# EAGLE design pc-004 (EAGLE 9.6.2)

## Sheet 1 of 2
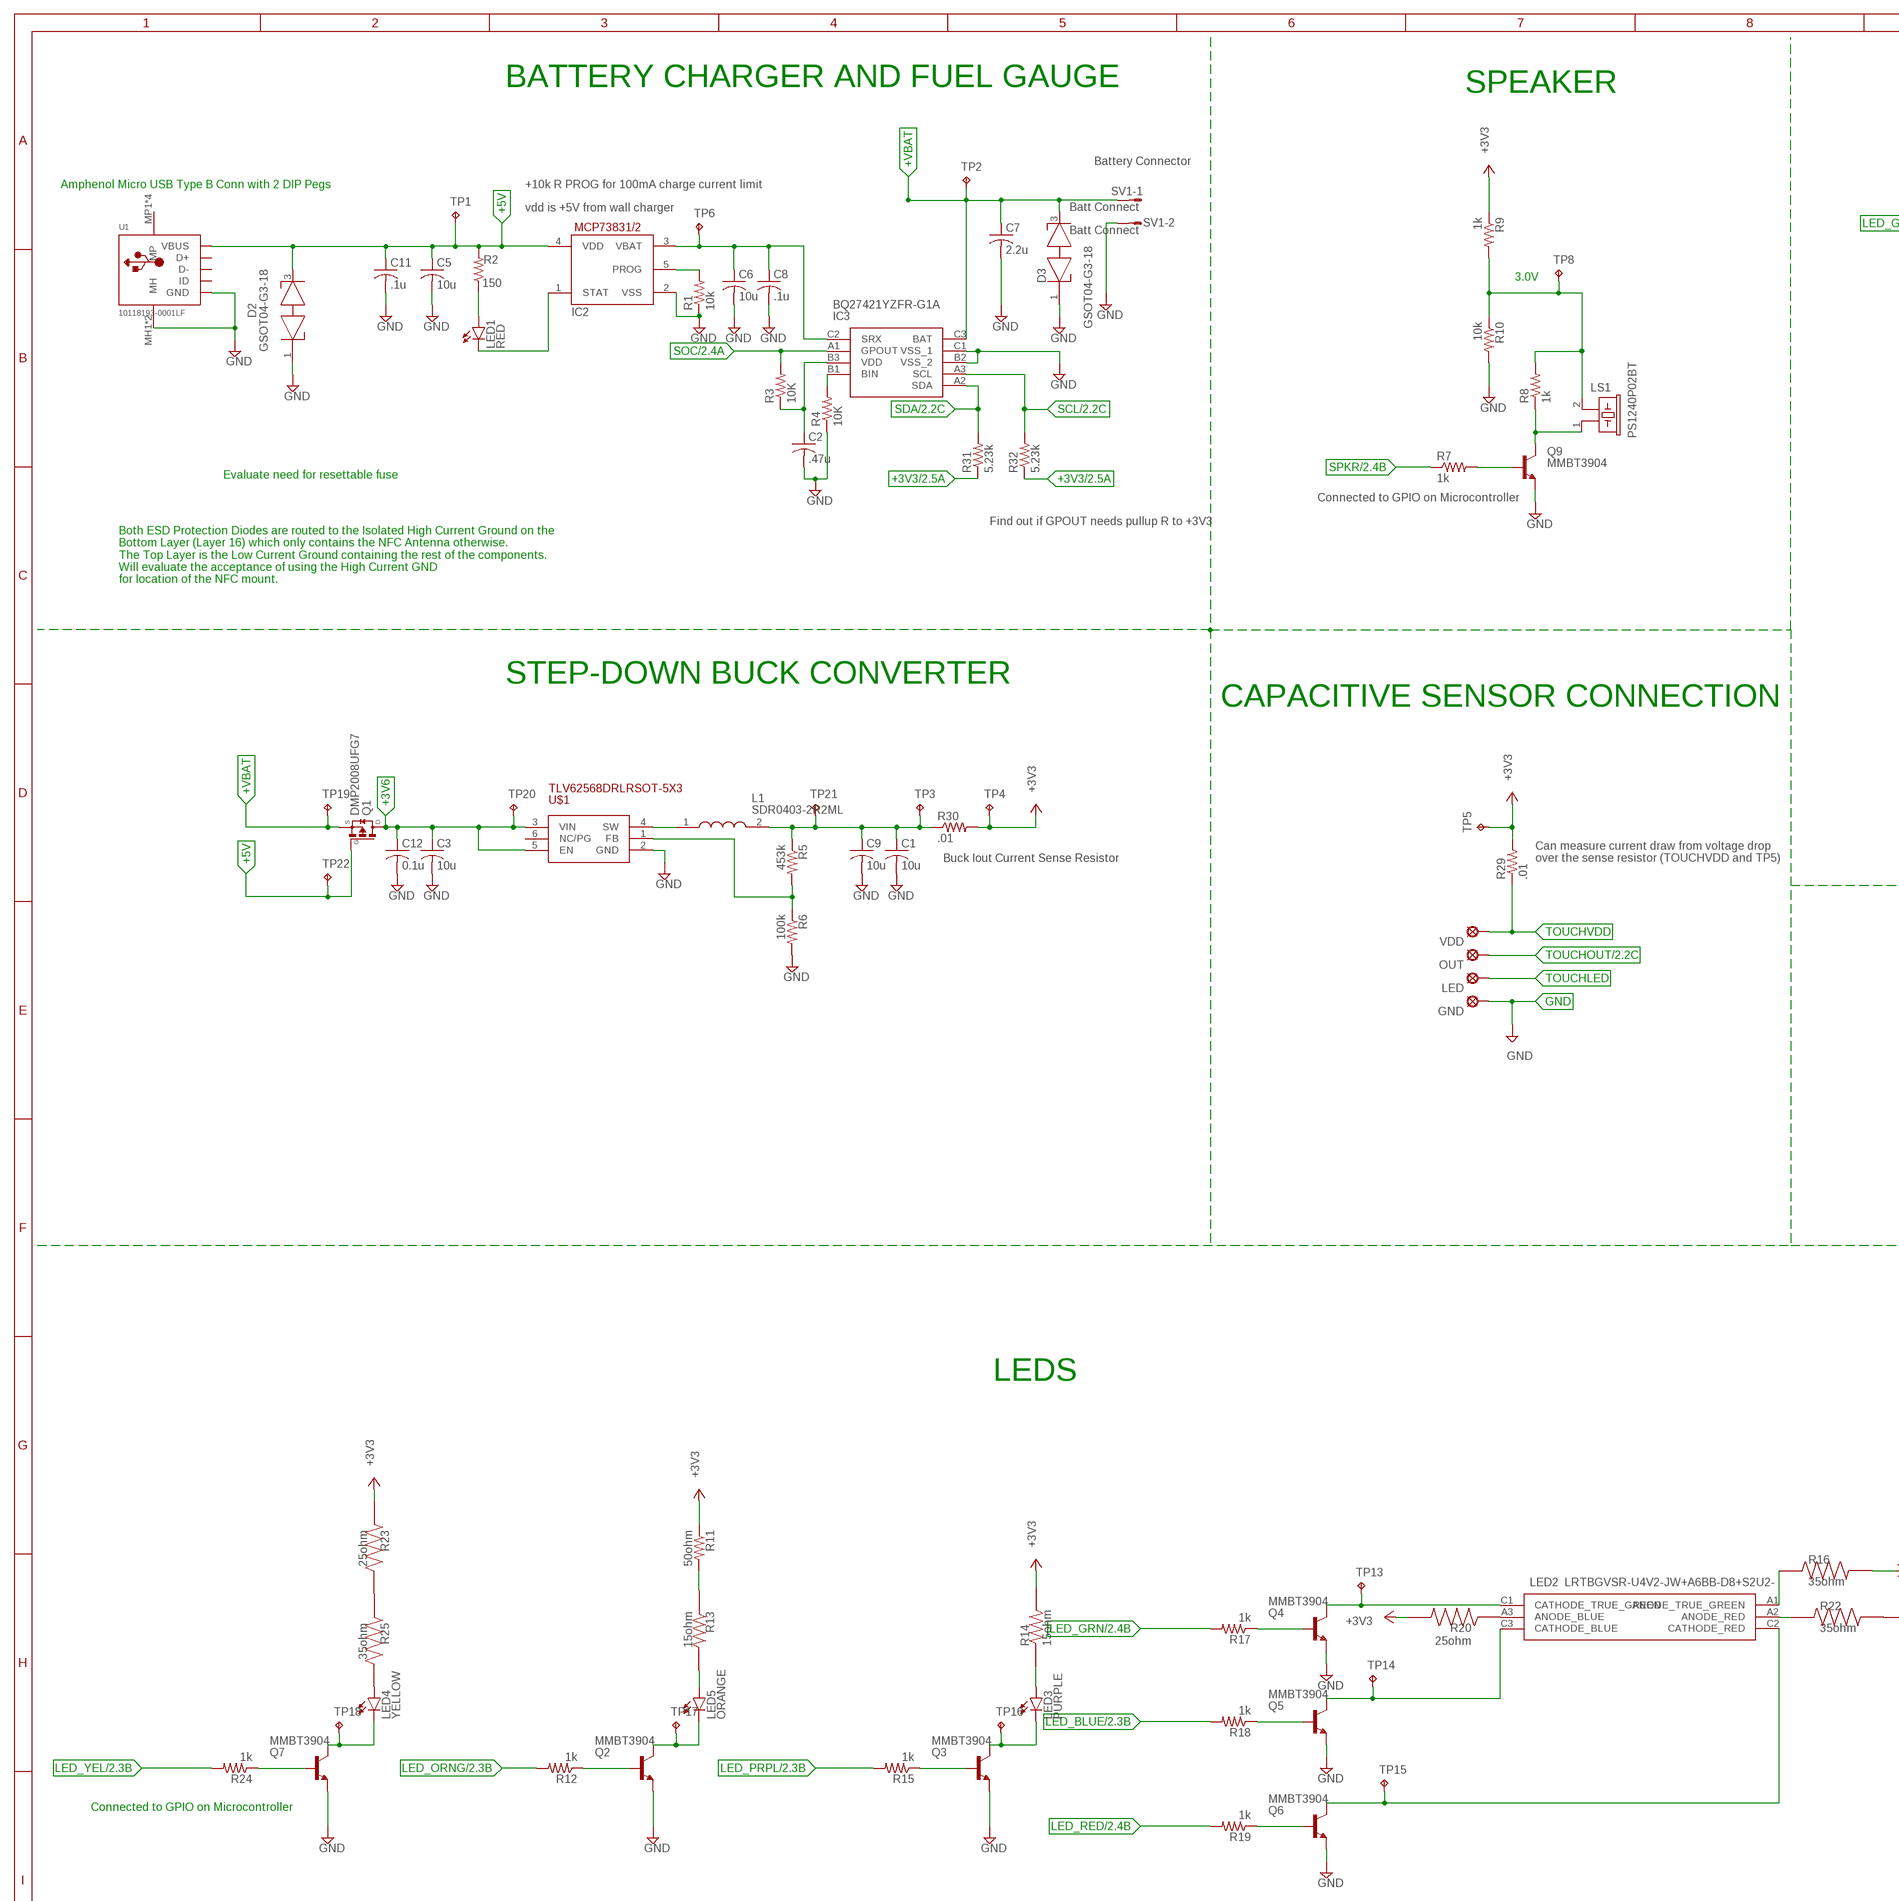
[diagram p0: schematic, sheet 1, part 1 of 2]
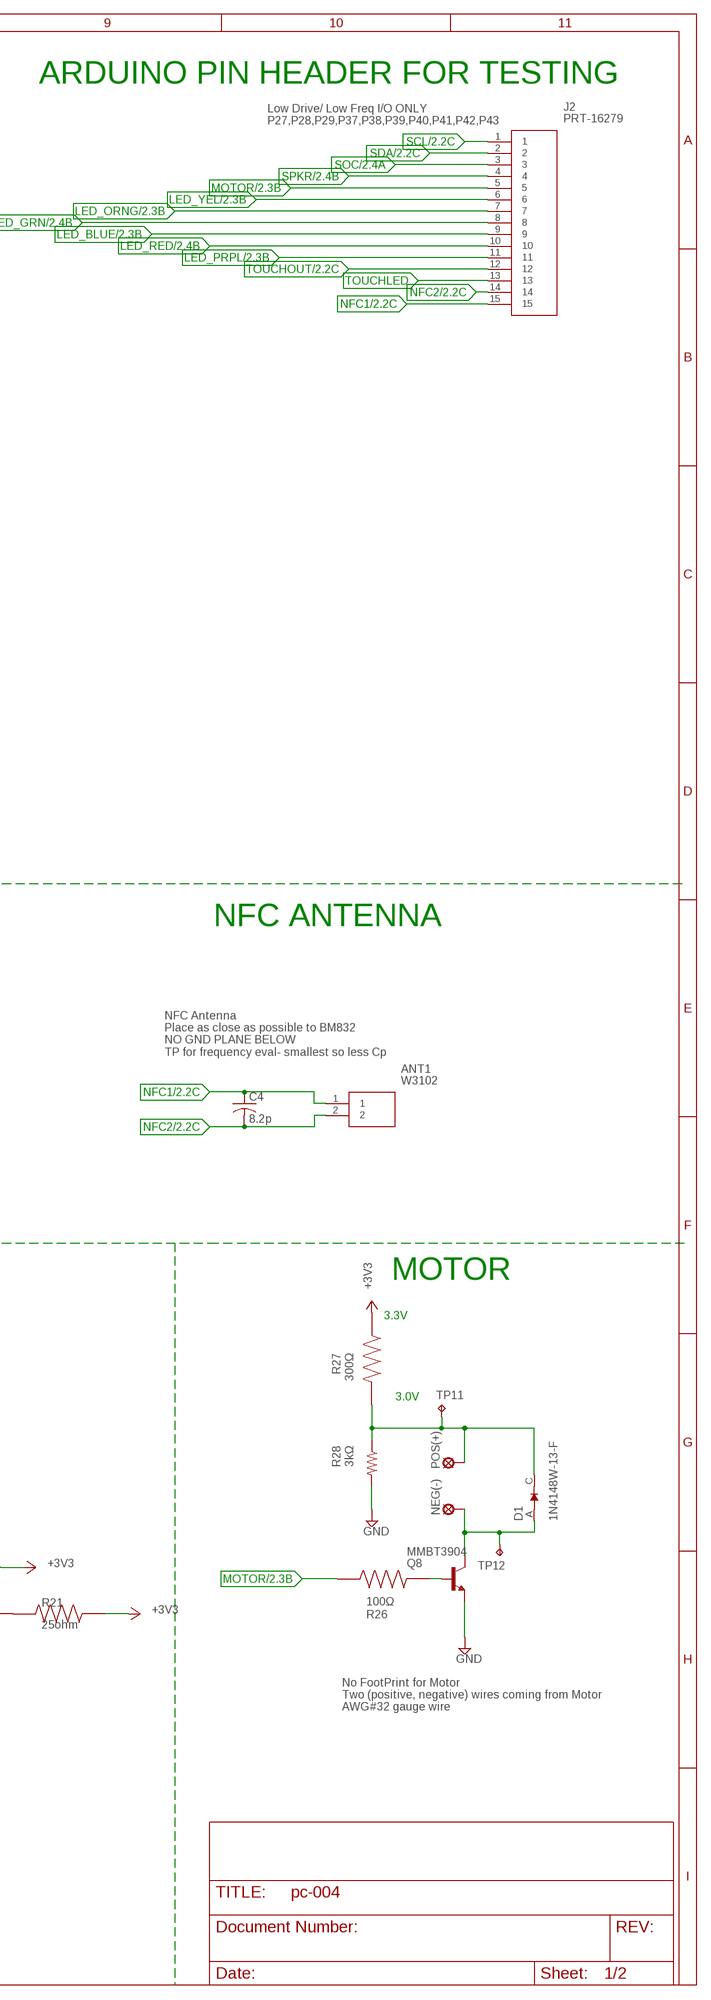
[diagram p1: schematic, sheet 1, part 2 of 2]

### Parts
ANT1  W3102  [W3102]
C1  10u  CL21A106KOQNNNE  [CAPC2012X140N]
C2  .47u  C-USC0603  [C0603]
C3  10u  CL21A106KOQNNNE  [CAPC2012X140N]
C4  8.2p  C-USC0402K  [C0402K]
C5  10u  CL21A106KOQNNNE  [CAPC2012X140N]
C6  10u  CL21A106KOQNNNE  [CAPC2012X140N]
C7  2.2u  C-USC0603  [C0603]
C8  .1u  C-USC0603  [C0603]
C9  10u  CL21A106KOQNNNE  [CAPC2012X140N]
C11  .1u  C-USC0603  [C0603]
C12  0.1u  C-USC0603  [C0603]
D1  1N4148W-13-F  [SOD3715X135N]
D2  GSOT04-G3-18  [SOT23]
D3  GSOT04-G3-18  [SOT23]
GND  LSP10  [LSP10]
IC2  MCP73831/OT  [SOT23-5L]
IC3  BQ27421YZFR-G1A  [BGA9C50P3X3_158X162X62]
J2  PRT-16279  [PRT16279]
L1  SDR0403-2R2ML  [SDR04032R2ML]
LED  LSP10  [LSP10]
LED1  RED  150060RS75000  [LEDC1608X80N]
LED2  LRTBGVSR-U4V2-JW+A6BB-D8+S2U2-  [LRTBGVSRU4V2JWA6BBD8S2U27Z20S]
LED3  PURPLE  APTR3216-VFX  [LEDC3216X125N]
LED4  YELLOW  SML-D15YWT86CYELLOW  [SML0603]
LED5  ORANGE  SML-D15YWT86CORANGE  [SML0603]
LS1  PS1240P02BT  [PS1240P02BT]
NEG(-)  LSP10  [LSP10]
OUT  LSP10  [LSP10]
POS(+)  LSP10  [LSP10]
Q1  DMP2008UFG7  DMP2008UFG  [DMP2008UFG7]
Q2  MMBT3904  MMBT3904-7-FNSMD  [SOT23]
Q3  MMBT3904  MMBT3904-7-FNSMD  [SOT23]
Q4  MMBT3904  MMBT3904-7-FNSMD  [SOT23]
Q5  MMBT3904  MMBT3904-7-FNSMD  [SOT23]
Q6  MMBT3904  MMBT3904-7-FNSMD  [SOT23]
Q7  MMBT3904  MMBT3904-7-FNSMD  [SOT23]
Q8  MMBT3904  MMBT3904-7-FNSMD  [SOT23]
Q9  MMBT3904  MMBT3904-7-FNSMD  [SOT23]
R1  10k  R-US_R0402  [R0402]
R2  150  R-US_R0402  [R0402]
R3  10K  R-US_R0402  [R0402]
R4  10K  R-US_R0402  [R0402]
R5  453k  R-US_R0402  [R0402]
R6  100k  R-US_R0603  [R0603]
R7  1k  CRCW06031K00FKEAC  [RESC1608X55N]
R8  1k  CRCW06031K00FKEAC  [RESC1608X55N]
R9  1k  CRCW06031K00FKEAC  [RESC1608X55N]
R10  10k  R-US_R0402  [R0402]
R11  50ohm  RT0402BRE0750RL  [RESC1005X35N]
R12  1k  CRCW06031K00FKEAC  [RESC1608X55N]
R13  15ohm  SR0603JR-0715RL  [RESC1608X55N]
R14  15ohm  SR0603JR-0715RL  [RESC1608X55N]
R15  1k  CRCW06031K00FKEAC  [RESC1608X55N]
R16  35ohm  RT0603BRD0735R2L  [RESC1608X55N]
R17  1k  CRCW06031K00FKEAC  [RESC1608X55N]
R18  1k  CRCW06031K00FKEAC  [RESC1608X55N]
R19  1k  CRCW06031K00FKEAC  [RESC1608X55N]
R20  25ohm  RQ73C2A25R5BTD  [RESC2012X65N]
R21  25ohm  RQ73C2A25R5BTD  [RESC2012X65N]
R22  35ohm  RT0603BRD0735R2L  [RESC1608X55N]
R23  25ohm  RQ73C2A25R5BTD  [RESC2012X65N]
R24  1k  CRCW06031K00FKEAC  [RESC1608X55N]
R25  35ohm  RT0603BRD0735R2L  [RESC1608X55N]
R26  100Ω  SR0603FR-7T100RL  [RESC1608X55N]
R27  300Ω  CRCW1206300RFKEAC  [RESC3015X65N]
R28  3kΩ  CR1206-FX-3001ELF  [RESC3216X75N]
R29  .01  R-US_R0603  [R0603]
R30  .01  PCS1206DR0100ET  [RESC3216X68N]
R31  5.23k  R-US_R0603  [R0603]
R32  5.23k  R-US_R0603  [R0603]
SV1  Batt Connect  L02P  [L02P]
TP1  TESTPOINT  [TESTPOINT_PAD-036]
TP2  TESTPOINT  [TESTPOINT_PAD-036]
TP3  TESTPOINT  [TESTPOINT_PAD-036]
TP4  TESTPOINT  [TESTPOINT_PAD-036]
TP5  TESTPOINT  [TESTPOINT_PAD-036]
TP6  TESTPOINT  [TESTPOINT_PAD-036]
TP8  TESTPOINT  [TESTPOINT_PAD-036]
TP11  TESTPOINT  [TESTPOINT_PAD-036]
TP12  TESTPOINT  [TESTPOINT_PAD-036]
TP13  TESTPOINT  [TESTPOINT_PAD-036]
TP14  TESTPOINT  [TESTPOINT_PAD-036]
TP15  TESTPOINT  [TESTPOINT_PAD-036]
TP16  TESTPOINT  [TESTPOINT_PAD-036]
TP17  TESTPOINT  [TESTPOINT_PAD-036]
TP18  TESTPOINT  [TESTPOINT_PAD-036]
TP19  TESTPOINT  [TESTPOINT_PAD-036]
TP20  TESTPOINT  [TESTPOINT_PAD-036]
TP21  TESTPOINT  [TESTPOINT_PAD-036]
TP22  TESTPOINT  [TESTPOINT_PAD-036]
U1  10118193-0001LF  [101181930001LF]
U$1  TLV62568DRLRSOT-5X3  [SOT50P160X60-6N]
VDD  LSP10  [LSP10]

### Nets
+3V3: R9.1 R11.1 R14.2 R16.2 R20.2 R21.2 R23.1 R27.1 R29.2 R30.2 R31.1 R32.1 TP4.1(TP) TP5.1(TP) ; also sheet 2
+3V6: C3.1 C12.1 Q1.5(D) Q1.6(D) Q1.7(D) Q1.8(D) Q1.9(D) TP20.1(TP) U$1.3(VIN) U$1.5(EN)
+5V: C5.1 C11.1 D2.3(K2) IC2.4(VDD) Q1.4(G) R2.2 TP1.1(TP) TP22.1(TP) U1.1(VBUS)
+VBAT: C7.1 D3.3(K2) IC3.C3(BAT) Q1.1(S) Q1.2(S) Q1.3(S) SV1.1 TP2.1(TP) TP19.1(TP)
GND: C1.2 C2.2 C3.2 C5.2 C6.2 C7.2 C8.2 C9.2 C11.2 C12.2 D2.1(K1) D3.1(K1) GND.MP IC2.2(VSS) IC3.B2(VSS_2) IC3.C1(VSS_1) Q2.2(E) Q3.2(E) Q4.2(E) Q5.2(E) Q6.2(E) Q7.2(E) Q8.2(E) Q9.2(E) R1.1 R4.1 R6.2 R10.2 R28.2 SV1.2 U1.5(GND) U1.MH1(MH) U1.MH2(MH) U$1.2(GND) ; also sheet 2
LED_BLUE: J2.9 R18.2 ; also sheet 2
LED_GRN: J2.8 R17.2 ; also sheet 2
LED_ORNG: J2.7 R12.2 ; also sheet 2
LED_PRPL: J2.11 R15.2 ; also sheet 2
LED_RED: J2.10 R19.2 ; also sheet 2
LED_YEL: J2.6 R24.2 ; also sheet 2
MOTOR: J2.5 R26.1 ; also sheet 2
N$1: Q9.1(B) R7.2
N$3: LS1.1 Q9.3(C) R8.1
N$4: IC2.5(PROG) R1.2
N$5: L1.1 U$1.4(SW)
N$6: R5.2 R6.1 U$1.1(FB)
N$7: IC2.1(STAT) LED1.1(C)
N$8: LED1.2(A) R2.1
N$9: Q8.1(B) R26.2
N$10: IC3.B1(BIN) R4.2
N$12: LS1.2 R8.2 R9.2 R10.1 TP8.1(TP)
N$13: D1.C(K) POS(+).MP R27.2 R28.1 TP11.1(TP)
N$14: Q2.1(B) R12.1
N$15: LED5.C Q2.3(C) TP17.1(TP)
N$16: R11.2 R13.1
N$17: LED5.A R13.2
N$18: C1.1 C9.1 L1.2 R5.1 R30.1 TP3.1(TP) TP21.1(TP)
N$19: Q3.1(B) R15.1
N$20: LED3.1(C) Q3.3(C) TP16.1(TP)
N$21: LED3.2(A) R14.1
N$22: R21.1 R22.2
N$23: Q4.1(B) R17.1
N$24: LED2.C1(CATHODE_TRUE_GREEN) Q4.3(C) TP13.1(TP)
N$25: D1.A NEG(-).MP Q8.3(C) TP12.1(TP)
N$26: Q5.1(B) R18.1
N$27: C6.1 C8.1 IC2.3(VBAT) IC3.C2(SRX) TP6.1(TP)
N$28: Q6.1(B) R19.1
N$29: LED2.C3(CATHODE_BLUE) Q5.3(C) TP14.1(TP)
N$30: LED2.A3(ANODE_BLUE) R20.1
N$31: LED2.A1(ANODE_TRUE_GREEN) R16.1
N$32: LED2.C2(CATHODE_RED) Q6.3(C) TP15.1(TP)
N$33: LED2.A2(ANODE_RED) R22.1
N$36: Q7.1(B) R24.1
N$37: LED4.C Q7.3(C) TP18.1(TP)
N$38: LED4.A R25.2
N$39: R23.2 R25.1
N$43: C2.1 IC3.B3(VDD) R3.1
NFC1: ANT1.1 C4.1 J2.15 ; also sheet 2
NFC2: ANT1.2 C4.2 J2.14 ; also sheet 2
SCL: IC3.A3(SCL) J2.1 R32.2 ; also sheet 2
SDA: IC3.A2(SDA) J2.2 R31.2 ; also sheet 2
SOC: IC3.A1(GPOUT) J2.3 R3.2 ; also sheet 2
SPKR: J2.4 R7.1 ; also sheet 2
TOUCHLED: J2.13 LED.MP
TOUCHOUT: J2.12 OUT.MP ; also sheet 2
TOUCHVDD: R29.1 VDD.MP
Unconnected: U1.2(D+) U1.3(D-) U1.4(ID) U1.MP1(MP) U1.MP2(MP) U1.MP3(MP) U1.MP4(MP) U$1.6(NC/PG)

### Notes on the sheet
- BATTERY CHARGER AND FUEL GAUGE | SPEAKER | ARDUINO PIN HEADER FOR TESTING
- Low Drive/ Low Freq I/O ONLY
  P27,P28,P29,P37,P38,P39,P40,P41,P42,P43
- Battery Connector
- Amphenol Micro USB Type B Conn with 2 DIP Pegs | +10k R PROG for 100mA charge current limit
- vdd is +5V from wall charger
- 3.0V
- Evaluate need for resettable fuse
- Connected to GPIO on Microcontroller
- Find out if GPOUT needs pullup R to +3V3
- Both ESD Protection Diodes are routed to the Isolated High Current Ground on the 
  Bottom Layer (Layer 16) which only contains the NFC Antenna otherwise. 
  The Top Layer is the Low Current Ground containing the rest of the components. 
  Will evaluate the acceptance of using the High Current GND 
  for location of the NFC mount.
- STEP-DOWN BUCK CONVERTER
- CAPACITIVE SENSOR CONNECTION
- Buck Iout Current Sense Resistor
- Can measure current draw from voltage drop 
  over the sense resistor (TOUCHVDD and TP5)
- NFC ANTENNA
- NFC Antenna
  Place as close as possible to BM832
  NO GND PLANE BELOW
  TP for frequency eval- smallest so less Cp
- MOTOR
- 3.3V
- LEDS
- 3.0V
- No FootPrint for Motor 
  Two (positive, negative) wires coming from Motor
  AWG#32 gauge wire
- Connected to GPIO on Microcontroller

## Sheet 2 of 2
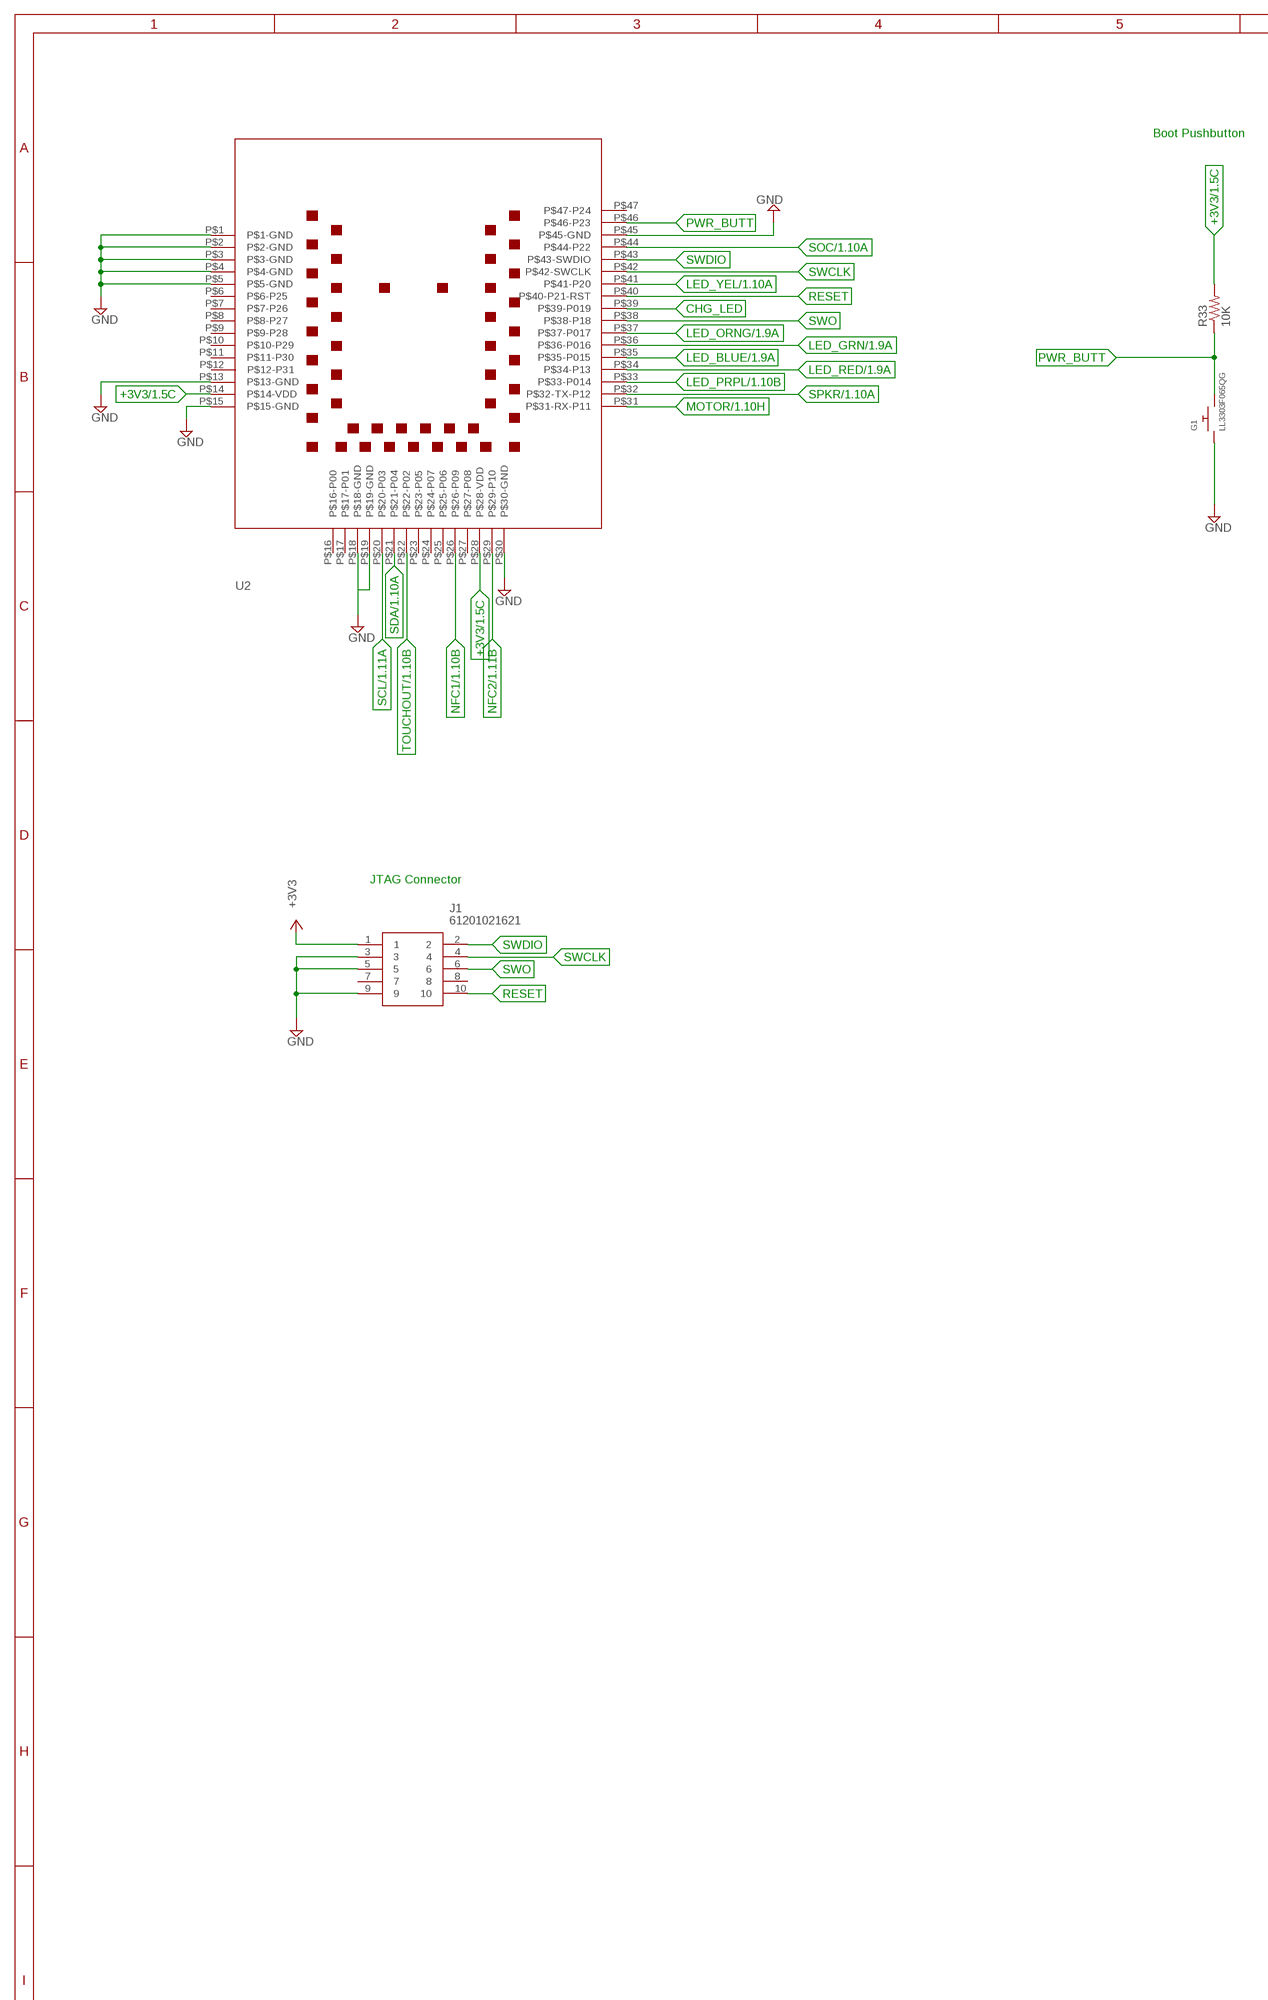
[diagram p2: schematic, sheet 2, part 1 of 2]
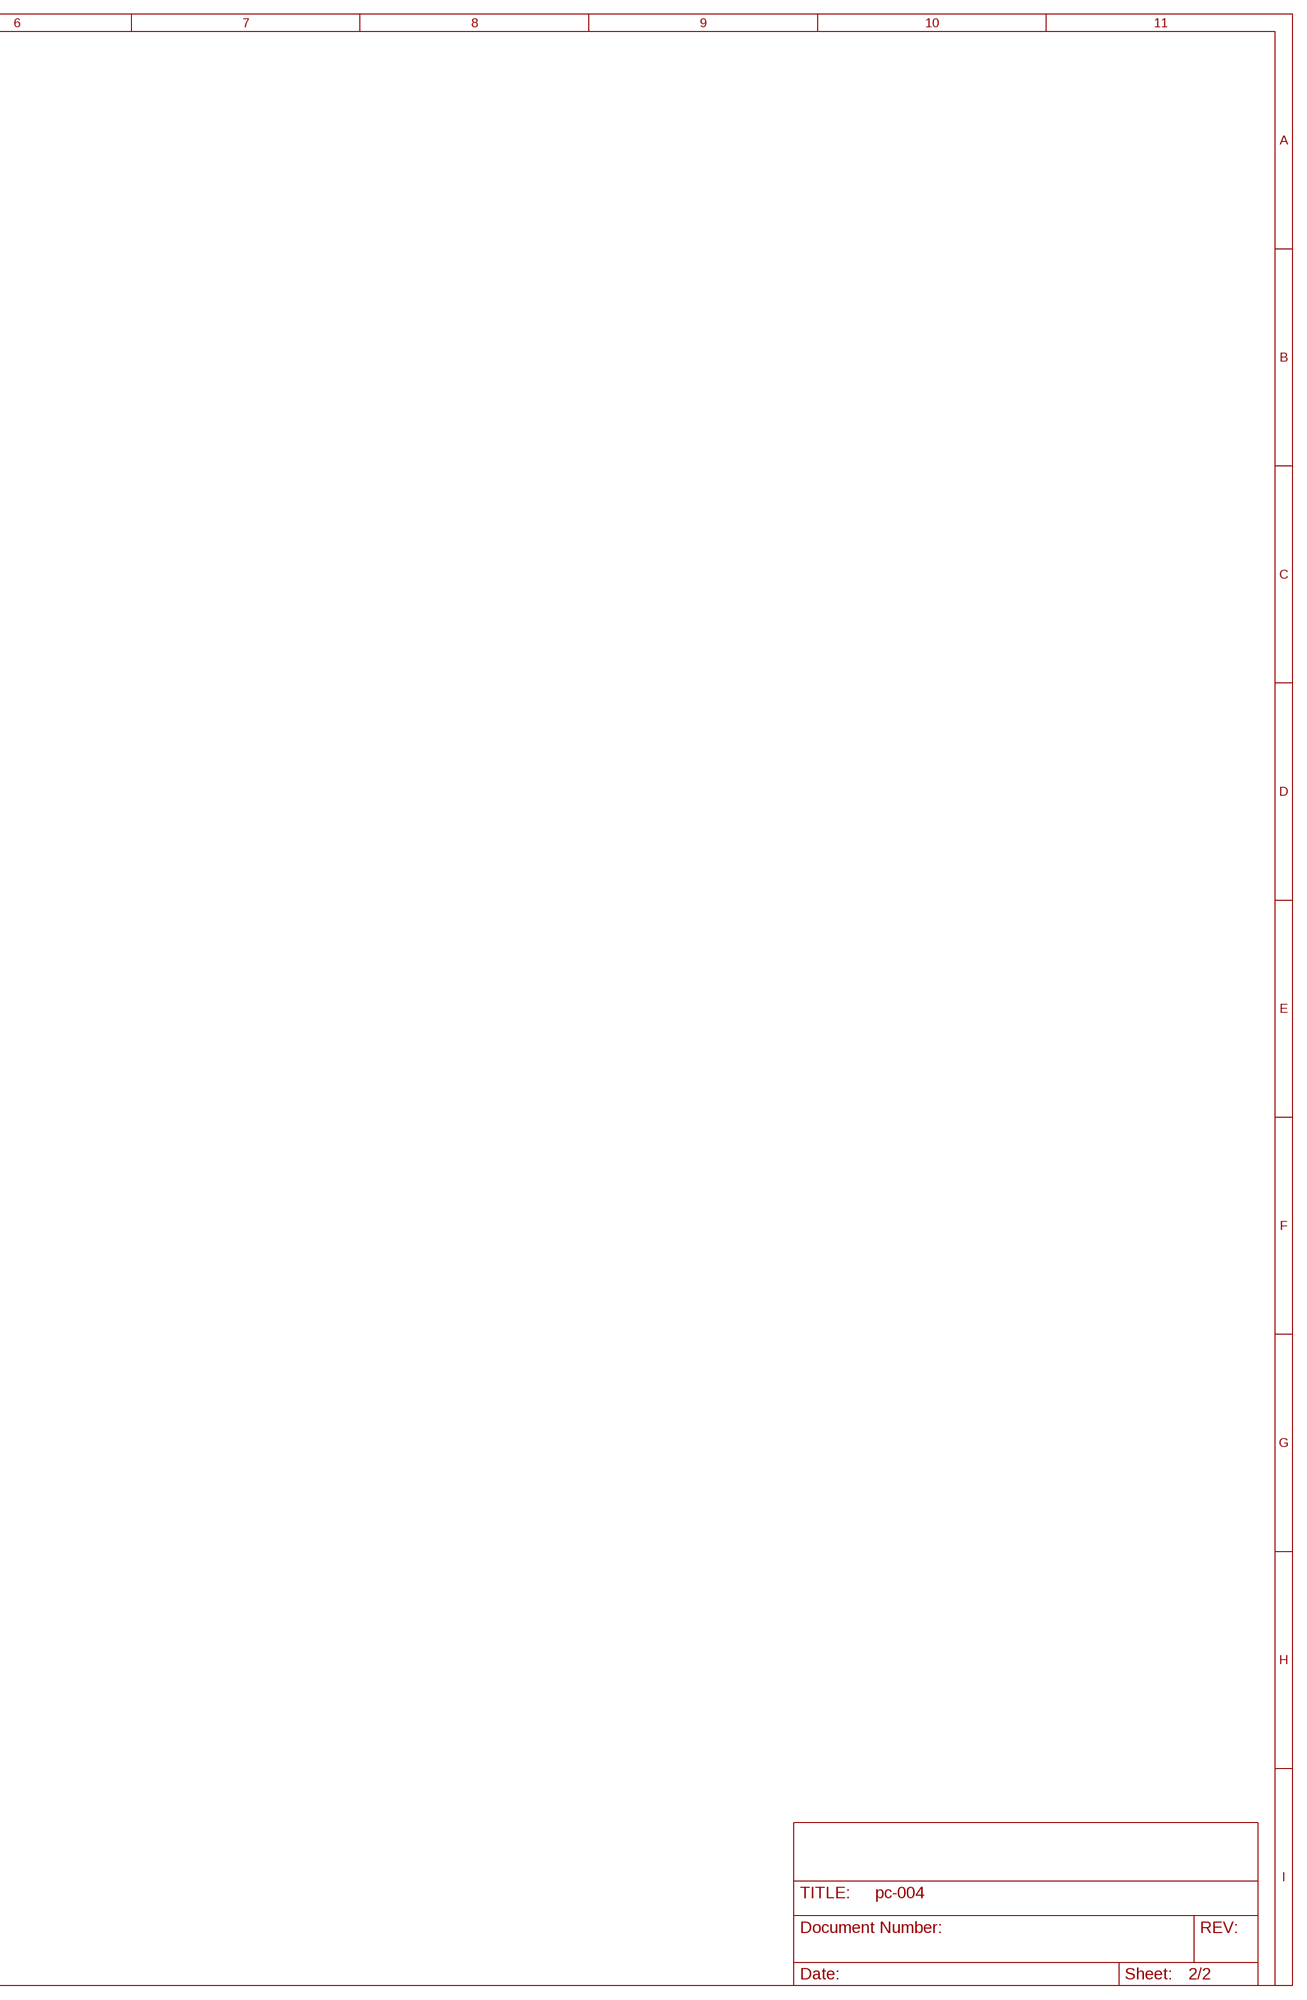
[diagram p3: schematic, sheet 2, part 2 of 2]

### Parts
G1  LL3303F065QG  [LL3303F065QG]
J1  61201021621  [SHDR10W64P254_2X5_2036X885X925]
R33  10K  R-US_R0402  [R0402]
U2  BM832  [BM832]

### Nets
+3V3: J1.1 R33.2 U2.P$14(P$14-VDD) U2.P$28(P$28-VDD) ; also sheet 1
CHG_LED: U2.P$39(P$39-P019)
GND: G1.P$1 G1.P$2 J1.3 J1.5 J1.9 U2.P$1(P$1-GND) U2.P$2(P$2-GND) U2.P$3(P$3-GND) U2.P$4(P$4-GND) U2.P$5(P$5-GND) U2.P$13(P$13-GND) U2.P$15(P$15-GND) U2.P$18(P$18-GND) U2.P$19(P$19-GND) U2.P$30(P$30-GND) U2.P$45(P$45-GND) ; also sheet 1
LED_BLUE: U2.P$35(P$35-P015) ; also sheet 1
LED_GRN: U2.P$36(P$36-P016) ; also sheet 1
LED_ORNG: U2.P$37(P$37-P017) ; also sheet 1
LED_PRPL: U2.P$33(P$33-P014) ; also sheet 1
LED_RED: U2.P$34(P$34-P13) ; also sheet 1
LED_YEL: U2.P$41(P$41-P20) ; also sheet 1
MOTOR: U2.P$31(P$31-RX-P11) ; also sheet 1
NFC1: U2.P$26(P$26-P09) ; also sheet 1
NFC2: U2.P$29(P$29-P10) ; also sheet 1
PWR_BUTT: G1.P$3 G1.P$4 R33.1 U2.P$46(P$46-P23)
RESET: J1.10 U2.P$40(P$40-P21-RST)
SCL: U2.P$20(P$20-P03) ; also sheet 1
SDA: U2.P$21(P$21-P04) ; also sheet 1
SOC: U2.P$44(P$44-P22) ; also sheet 1
SPKR: U2.P$32(P$32-TX-P12) ; also sheet 1
SWCLK: J1.4 U2.P$42(P$42-SWCLK)
SWDIO: J1.2 U2.P$43(P$43-SWDIO)
SWO: J1.6 U2.P$38(P$38-P18)
TOUCHOUT: U2.P$22(P$22-P02) ; also sheet 1
Unconnected: J1.7 J1.8 U2.P$6(P$6-P25) U2.P$7(P$7-P26) U2.P$8(P$8-P27) U2.P$9(P$9-P28) U2.P$10(P$10-P29) U2.P$11(P$11-P30) U2.P$12(P$12-P31) U2.P$16(P$16-P00) U2.P$17(P$17-P01) U2.P$23(P$23-P05) U2.P$24(P$24-P07) U2.P$25(P$25-P06) U2.P$27(P$27-P08) U2.P$47(P$47-P24)

### Notes on the sheet
- Boot Pushbutton
- JTAG Connector

## Library data of the parts
ANT1 = SamacSys_Parts:W3102: Antennas Ant Embedded NFC 13.56MHz Source: Datasheet <https://productfinder.pulseeng.com/doc_type/WEB301/doc_num/W3102/doc_part/W3102-1851 TDS.pdf>; DESCRIPTION: Antennas Ant Embedded NFC 13.56MHz; HEIGHT: 5.35mm; MANUFACTURER_NAME: Pulse; MANUFACTURER_PART_NUMBER: W3102; MOUSER_PART_NUMBER: 673-W3102; MOUSER_PRICE-STOCK: https://www.mouser.co.uk/ProductDetail/PulseLarsen-Antennas/W3102/?qs=l7cgNqFNU1hiMYyn%252B8mDRg%3D%3D
C1 C3 C5 C6 C9 = tesseract:CL21A106KOQNNNE
C2 C4 C7 C8 C11 C12 = rcl:C-US: CAPACITOR, American symbol; SPICEPREFIX: C
D1 = 1N4148W-13-F:1N4148W-13-F: 1N4148W Series 2 A 100 V 400 mW Surface Mount Fast Switching Diode - SOD-123 Check prices <https://pricing.snapeda.com/parts/1N4148W-13-F/Diodes%20Zetex/view-part?ref=eda>; AVAILABILITY: Warning; DESCRIPTION: Rectifier Diode Small Signal Switching 100V 0.3A 4ns 2-Pin SOD-123 T/R; MF: Diodes Zetex; MP: 1N4148W-13-F; PACKAGE: None; PRICE: None; PURCHASE-URL: https://pricing.snapeda.com/search/part/1N4148W-13-F/?ref=eda
D2 D3 = tesseract:GSOT04-G3-18
G1 = tesseract:LL3303F065QG
GND LED NEG(-) OUT POS(+) VDD = solpad:LSP10: SOLDER PAD drill 1.0 mm, distributor Buerklin, 12H555
IC2 = adafruit:MCP73831: MCP73831/2 Miniature Single-Cell, Fully Integrated Li-Ion, Li-Polymer Charge Management Controllers. Nice and small simple lipoly charge controller, with adjustable current and status output (LED) http://www.ladyada.net/library/pcb/eaglelibrary.html
IC3 = tesseract:BQ27421YZFR-G1A
J1 = SamacSys_Parts:61201021621: 10 way 2.54mm male box Header Wurth Elektronik 612 Series, 2.54mm Pitch 10 Way 2 Row Straight PCB Header, Solder Termination, 3A Source: Datasheet; DESCRIPTION: 10 way 2.54mm male box Header Wurth Elektronik 612 Series, 2.54mm Pitch 10 Way 2 Row Straight PCB Header, Solder Termination, 3A; HEIGHT: 9.25mm; MANUFACTURER_NAME: Wurth Elektronik; MANUFACTURER_PART_NUMBER: 61201021621; MOUSER_PART_NUMBER: 710-61201021621; MOUSER_PRICE-STOCK: https://www.mouser.co.uk/ProductDetail/Wurth-Elektronik/61201021621?qs=W%252B2sBeLta1a0dwX5pxbfXw%3D%3D
J2 = SamacSys_Parts:PRT-16279: ARDUINO NANO STACKABLE HEADERS Source: Datasheet <https://cdn.sparkfun.com/assets/8/d/8/4/7/DS-16279-Arduino_Nano_Stackable_Header_Kit.pdf>; DESCRIPTION: ARDUINO NANO STACKABLE HEADERS; HEIGHT: 8.65mm; MANUFACTURER_NAME: SparkFun; MANUFACTURER_PART_NUMBER: PRT-16279; MOUSER_PART_NUMBER: 474-PRT-16279; MOUSER_PRICE-STOCK: https://www.mouser.co.uk/ProductDetail/SparkFun/PRT-16279?qs=vmHwEFxEFR8I6W1vfufYPg%3D%3D
L1 = SamacSys_Parts:SDR0403-2R2ML: Bourns SDR0403 Series Type SMD Wire-wound SMD Inductor with a Ferrite DR Core, 2.2 uH +/-20% 2.6A Idc Q:28 Source: Datasheet <https://www.bourns.com/docs/Product-Datasheets/sdr0403.pdf>; DESCRIPTION: Bourns SDR0403 Series Type SMD Wire-wound SMD Inductor with a Ferrite DR Core, 2.2 uH +/-20% 2.6A Idc Q:28; HEIGHT: 3.5mm; MANUFACTURER_NAME: Bourns; MANUFACTURER_PART_NUMBER: SDR0403-2R2ML; MOUSER_PART_NUMBER: 652-SDR0403-2R2ML; MOUSER_PRICE-STOCK: https://www.mouser.co.uk/ProductDetail/Bourns/SDR0403-2R2ML?qs=y9m3SKnhpLO4vEJCCQMjFg%3D%3D
LED1 = tesseract:150060RS75000
LED2 = LRTBGVSR-U4V2-JW+A6BB-D8+S2U2-:LRTBGVSR-U4V2-JW+A6BB-D8+S2U2-: Standard LEDs - SMD RGB LED OSIRE E3635 Source: Datasheet <https://componentsearchengine.com///C:/Users/jayres/Downloads/LRTB GVSR_EN (1).pdf>; DESCRIPTION: Standard LEDs - SMD RGB LED OSIRE E3635; HEIGHT: 2mm; MANUFACTURER_NAME: OSRAM; MANUFACTURER_PART_NUMBER: LRTBGVSR-U4V2-JW+A6BB-D8+S2U2-7Z-20-S; MOUSER_PART_NUMBER: 720-LRTBGVSRA8552; MOUSER_PRICE-STOCK: https://www.mouser.co.uk/ProductDetail/OSRAM-Opto-Semiconductors/LRTBGVSR-U4V2-JW%2bA6BB-D8%2bS2U2-7Z-20-S?qs=sPbYRqrBIVl6x9fY0QkiyA%3D%3D
LED3 = tesseract:APTR3216-VFX
LED4 LED5 = tesseract:SML-D15YWT86C
LS1 = tesseract:PS1240P02BT: Audio Indicators & Alerts Round 12.2mmx6.5mm 4kHz Vin=3V Source: Datasheet; DESCRIPTION: Audio Indicators & Alerts Round 12.2mmx6.5mm 4kHz Vin=3V; HEIGHT: mm; MANUFACTURER_NAME: TDK; MANUFACTURER_PART_NUMBER: PS1240P02BT; MOUSER_PART_NUMBER: 810-PS1240P02BT; MOUSER_PRICE-STOCK: https://www.mouser.co.uk/ProductDetail/TDK/PS1240P02BT?qs=d7g9p1yFhWaZXSY9MjKMkw%3D%3D
Q1 = SamacSys_Parts:DMP2008UFG
Q2-Q9 = tesseract:MMBT3904-7-F
R1-R6 R10 R29 R31-R33 = rcl:R-US_: RESISTOR, American symbol; SPICEPREFIX: R
R7-R9 R12 R15 R17-R19 R24 = tesseract:CRCW06031K00FKEAC
R11 = tesseract:RT0402BRE0750RL
R13 R14 = tesseract:SR0603JR-0715RL: Check prices <https://pricing.snapeda.com/parts/SR0603JR-0715RL/Yageo/view-part?ref=eda>; AVAILABILITY: Bad; DESCRIPTION: Res Thick Film 0603 15 Ohm 5% 0.1W(1/10W) ±100ppm/°C Pad SMD Automotive T/R; MF: Yageo; MP: SR0603JR-0715RL; PACKAGE: 1608 Yageo; PRICE: None
R16 R22 R25 = tesseract:RT0603BRD0735R2L; AVAILABILITY: Unavailable; DESCRIPTION: 35.2 Ohms ±0.1% 0.1W, 1/10W Chip Resistor 0603 (1608 Metric) Thin Film; MF: Yageo; MP: RT0603BRD0735R2L; PACKAGE: 1608 Yageo; PRICE: None
R20 R21 R23 = tesseract:RQ73C2A25R5BTD: Check prices <https://pricing.snapeda.com/parts/RQ73C2A25R5BTD/TE%20Connectivity/view-part?ref=eda>; AVAILABILITY: Warning; COMMENT: 4-2176378-0; DESCRIPTION: 25.5 Ohms ±0.1% 0.2W, 1/5W Chip Resistor 0805 (2012 Metric) Anti-Sulfur, Automotive AEC-Q200 Thin Film; MF: TE Connectivity; MP: RQ73C2A25R5BTD; PACKAGE: 2012 Rohm Semiconductor; PRICE: None; PURCHASE-URL: https://pricing.snapeda.com/search/part/RQ73C2A25R5BTD/?ref=eda
R26 = tesseract:SR0603FR-7T100RL: Check prices <https://pricing.snapeda.com/parts/SR0603FR-7T100RL/Yageo/view-part?ref=eda>; AVAILABILITY: Warning; DESCRIPTION: 100 Ohms ±1% 0.25W, 1/4W Chip Resistor 0603 (1608 Metric) Automotive AEC-Q200, Pulse Withstanding Thick Film; MF: Yageo; MP: SR0603FR-7T100RL; PACKAGE: 1608 Yageo; PRICE: None
R27 = tesseract:CRCW1206300RFKEAC: Check prices <https://pricing.snapeda.com/parts/CRCW1206300RFKEAC/Vishay/view-part?ref=eda>; AVAILABILITY: Warning; DESCRIPTION: 300 Ohms ±1% 0.25W, 1/4W Chip Resistor 1206 (3216 Metric) Thick Film; MF: Vishay; MP: CRCW1206300RFKEAC; PACKAGE: 3015 Vishay; PRICE: None; PURCHASE-URL: https://pricing.snapeda.com/search/part/CRCW1206300RFKEAC/?ref=eda
R28 = tesseract:CR1206-FX-3001ELF
R30 = SamacSys_Parts:PCS1206DR0100ET: Current Sense Resistors - SMD 1W 0.010 OHMS 0.5% Source: Datasheet <https://componentsearchengine.com//PCS1206DR0100ET.pdf>; DESCRIPTION: Current Sense Resistors - SMD 1W 0.010 OHMS 0.5%; HEIGHT: 0.684mm; MANUFACTURER_NAME: Ohmite; MANUFACTURER_PART_NUMBER: PCS1206DR0100ET; MOUSER_PART_NUMBER: 588-PCS1206DR0100ET; MOUSER_PRICE-STOCK: https://www.mouser.co.uk/ProductDetail/Ohmite/PCS1206DR0100ET?qs=Zz7%252BYVVL6bH%2F2nwIEMOhrA%3D%3D
SV1 = con-amp-mt:L02P: AMP MT CONNECTOR; OC_FARNELL: unknown; OC_NEWARK: unknown
TP1-TP6 TP8 TP11-TP22 = tesseract:TESTPOINT
U1 = tesseract:10118193-0001LF
U2 = BM832-1:BM832
U$1 = tesseract:TLV62568DRLR

## Board
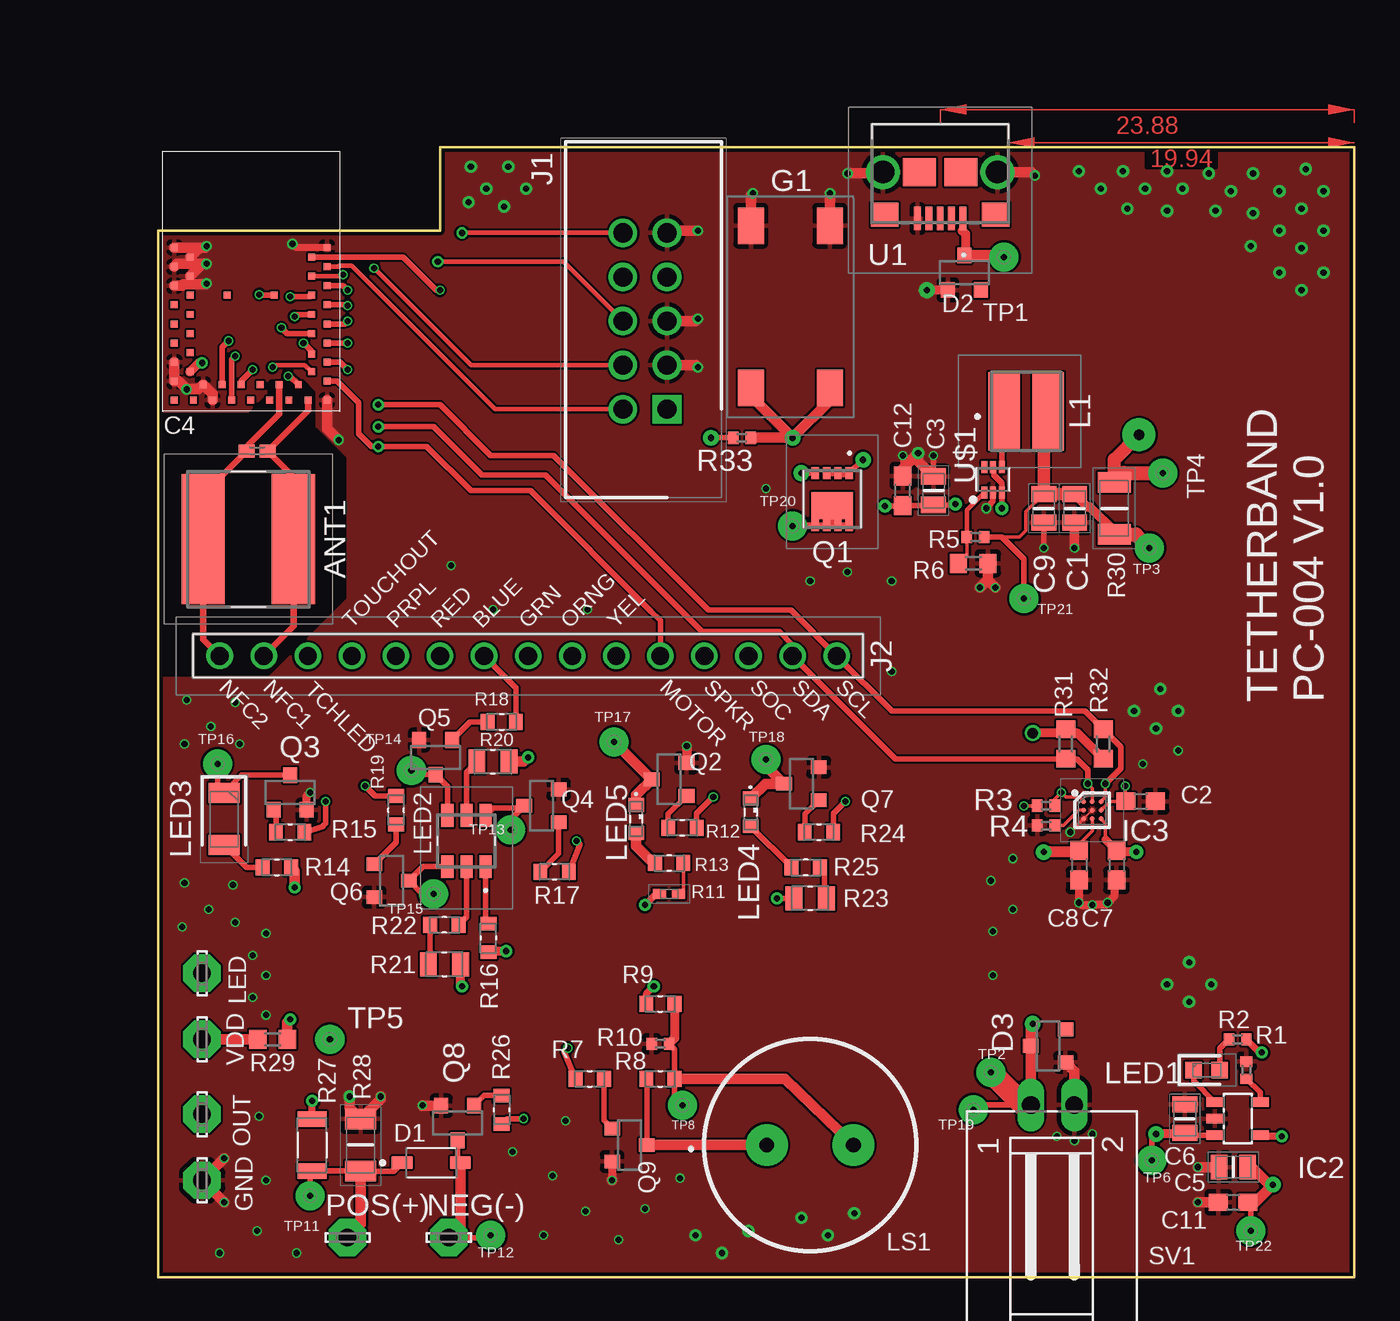
[diagram p4: board, top side]
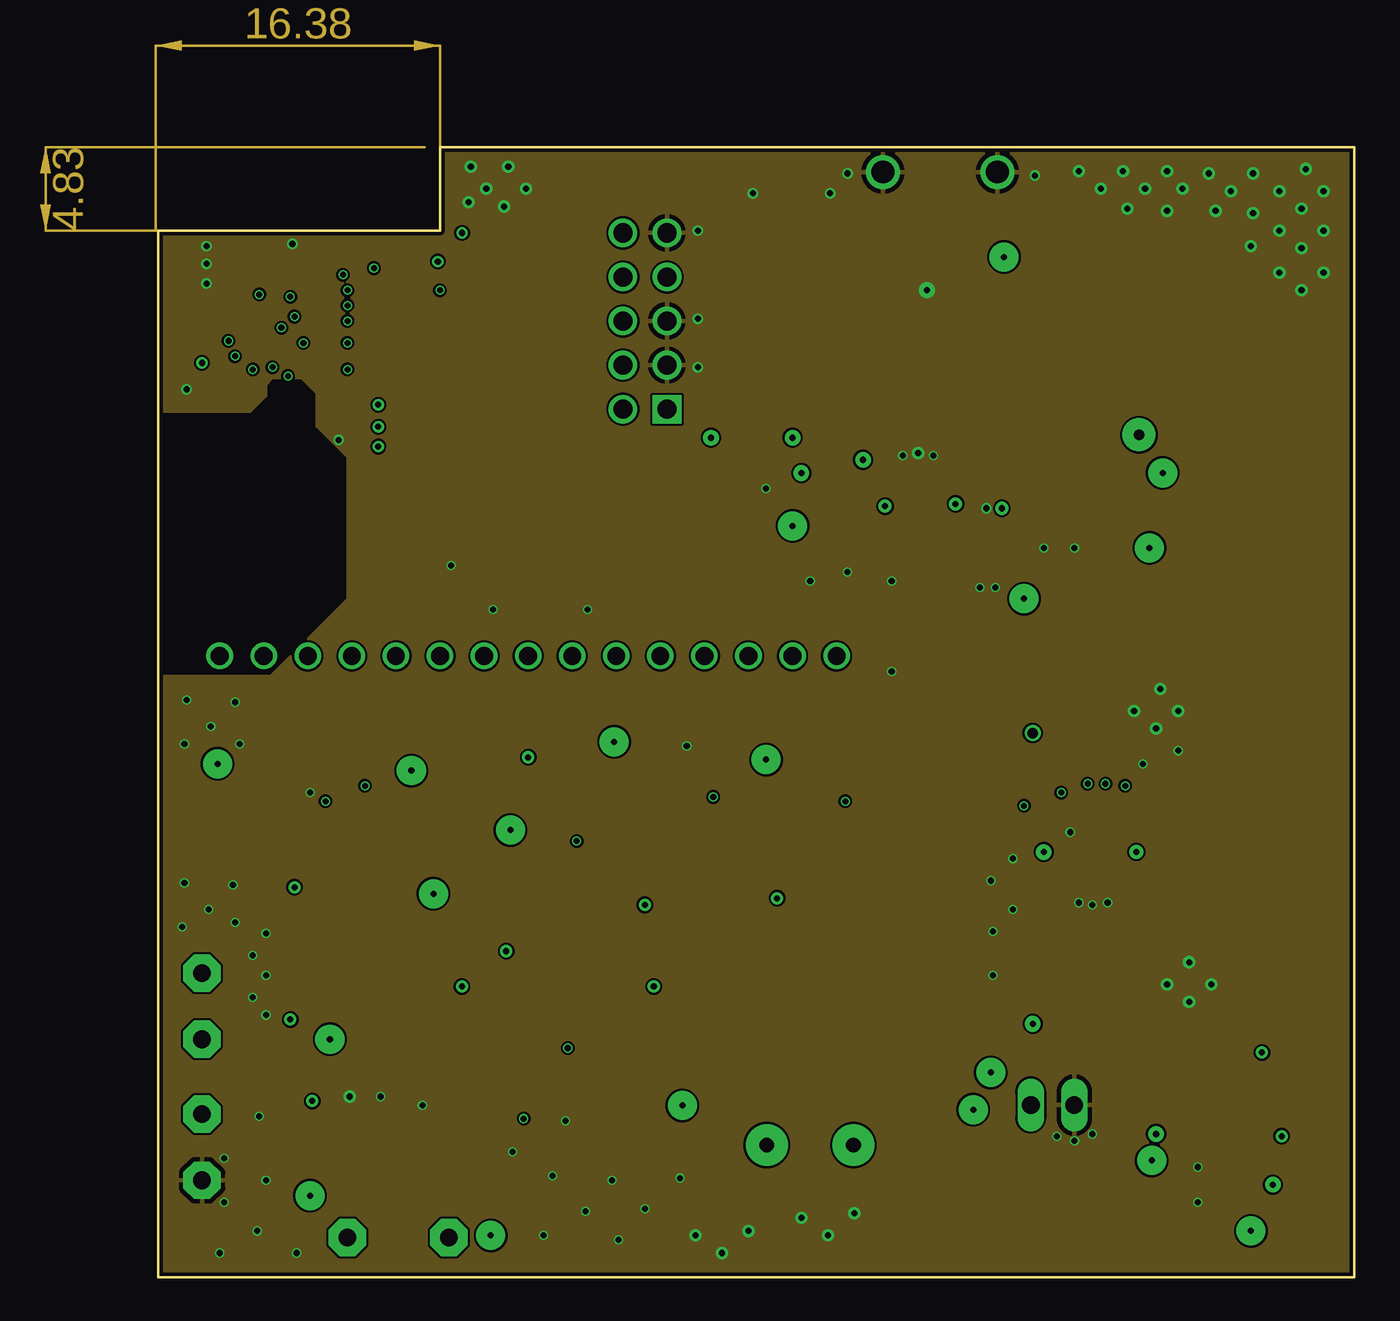
[diagram p5: board, inner layer Route2]
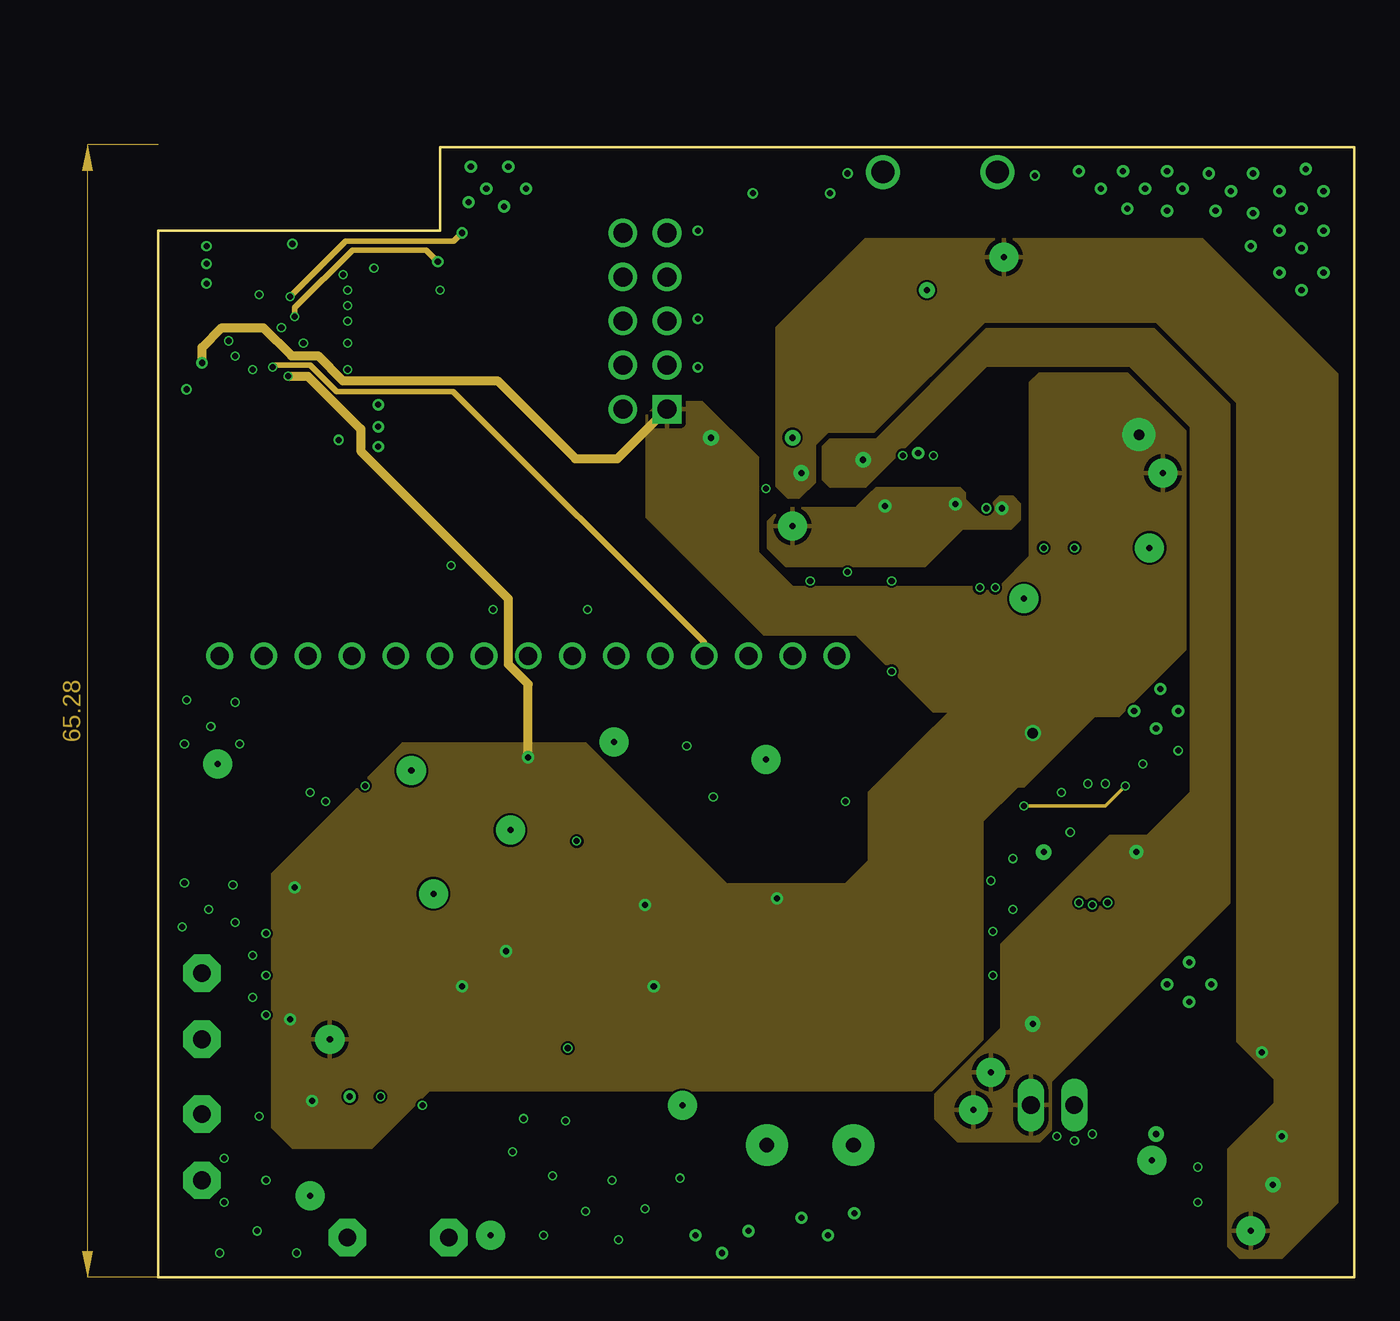
[diagram p6: board, inner layer Route15]
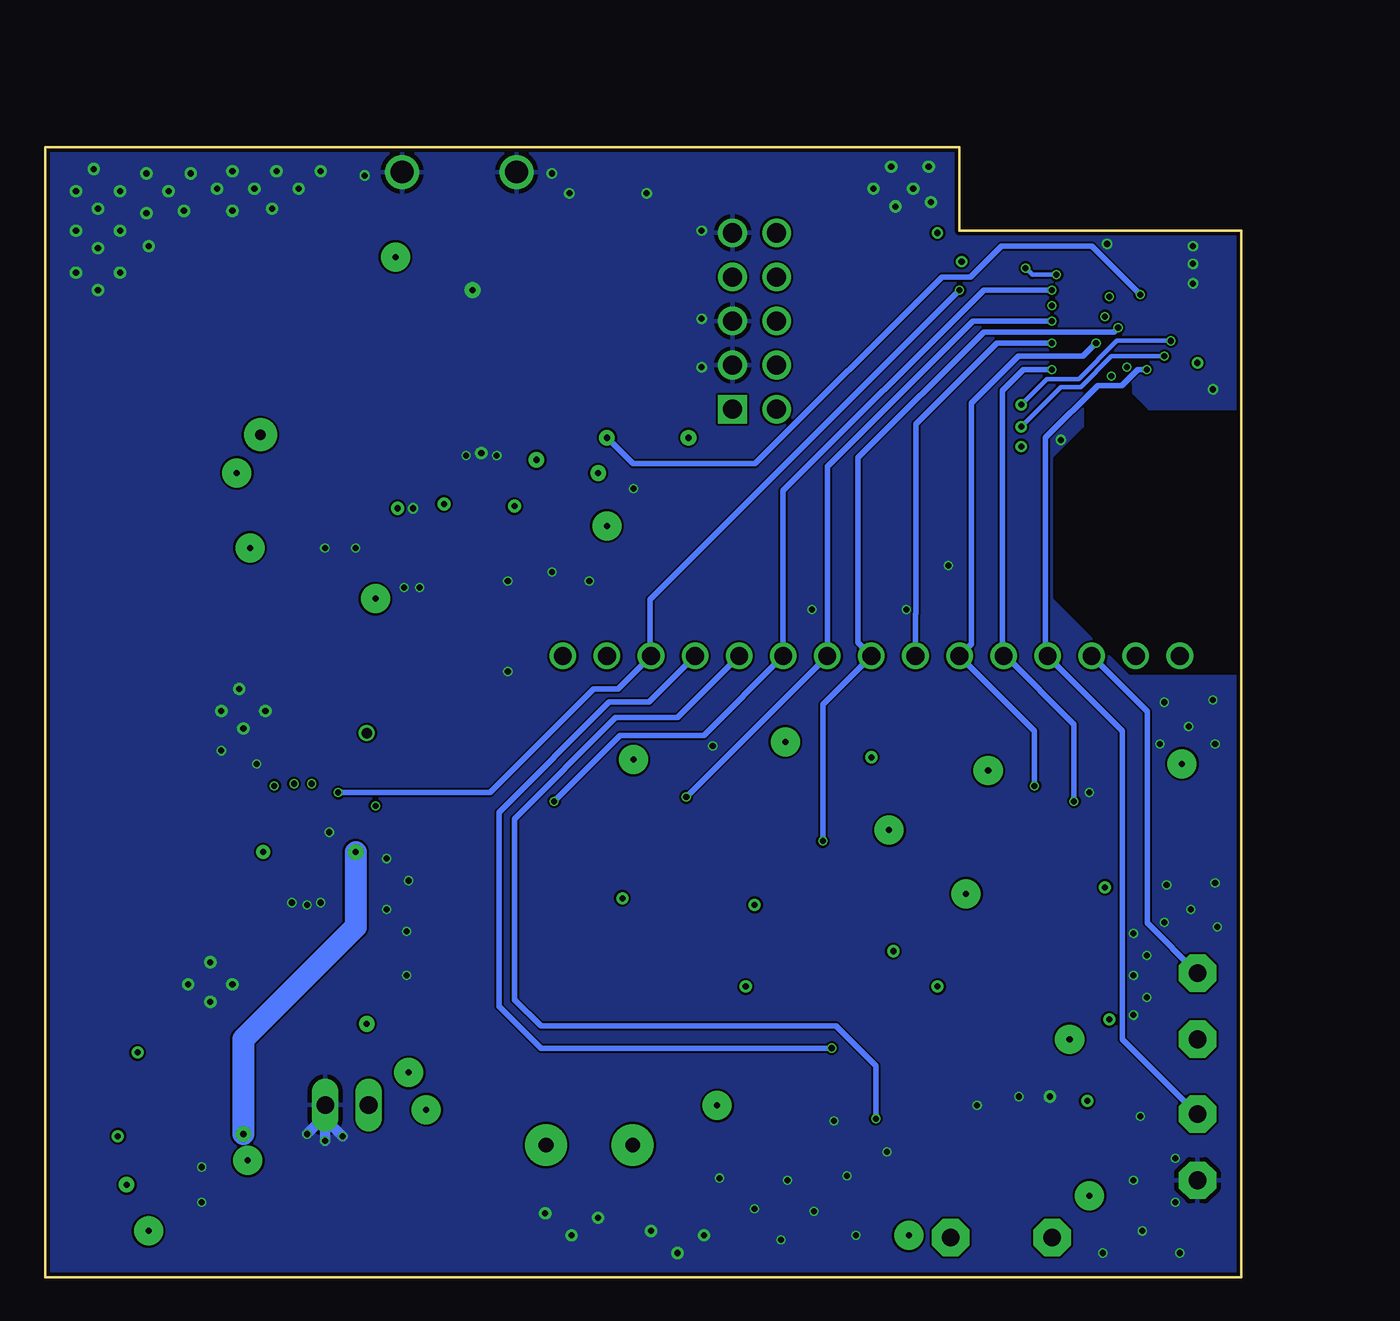
[diagram p7: board, bottom side, seen from below]

Size 68.96 x 65.15 mm. Coordinates in mm from the lower left corner, seen from the top.
Outline: 0,0 68.96,0 68.96,65.15 16.26,65.15 16.26,60.33 0,60.33 0,0
Copper layers (1+2*15+16): Top 0.035559375mm / dielectric 1.6mm / Route2 0.0356mm / dielectric 0.1499mm / Route15 0.0356mm / dielectric 0.2007mm / Bottom 0.035559375mm
Design rules "jlcpcb2layer *": minimum track width 5mil, minimum drill 8mil, track to track 5mil, track to pad 5mil, pad to pad 5mil, via to via 5mil, smd to smd 5mil, copper to edge 8mil, drill to drill 6mil, minimum pad ring 5mil, minimum via ring 3mil, stop-mask expansion 2.5mil, vias tented up to drill 0mil, thermal gap 10mil

### Footprints (pad centres in the part's own frame; a part is rotated, then mirrored left to right if it is on the bottom)
W3102 = smd 2.5 x 7.5: 1 -2.6,0; 2 2.6,0
CAPC2012X140N = smd 0.94 x 1.43: 1 -0.82,0; 2 0.82,0
C0603 = smd 1.1 x 1: 1 -0.85,0; 2 0.85,0
C0402K = smd 0.925 x 0.74: 1 -0.6,0; 2 0.6,0
SOD3715X135N = smd 1.21 x 0.73: A 1.68,0; C -1.68,0
SOT23 = smd 0.8 x 0.9: 1 -0.95,-1; 2 0.95,-1; 3 0,1
LL3303F065QG = smd 2.1 x 1.5: P$1 -4.6,2.4; P$2 -4.6,-2.15; P$3 4.75,2.4; P$4 4.75,-2.15
LSP10 = drill 1.016 pad 2.159 octagon: MP 0,0
SOT23-5L = smd 0.55 x 1: 1 -0.95,-1.3; 2 0,-1.3; 3 0.95,-1.3; 4 0.95,1.3; 5 -0.95,1.3
BGA9C50P3X3_158X162X62 = smd 0.29 x 0.29: A1 -0.5,0.5; A2 0,0.5; A3 0.5,0.5; B1 -0.5,0; B2 0,0; B3 0.5,0; C1 -0.5,-0.5; C2 0,-0.5; C3 0.5,-0.5
SHDR10W64P254_2X5_2036X885X925 = drill 1.1 pad 1.65 square: 1 0,0 | drill 1.1 pad 1.65: 2 0,2.54; 3 2.54,0; 4 2.54,2.54; 5 5.08,0; 6 5.08,2.54; 7 7.62,0; 8 7.62,2.54; 9 10.16,0; 10 10.16,2.54
PRT16279 = drill 1.02 pad 1.53: 1 0,0; 2 2.54,0; 3 5.08,0; 4 7.62,0; 5 10.16,0; 6 12.7,0; 7 15.24,0; 8 17.78,0; 9 20.32,0; 10 22.86,0; 11 25.4,0; 12 27.94,0; 13 30.48,0; 14 33.02,0; 15 35.56,0
SDR04032R2ML = smd 4.5 x 1.8: 1 0,1.27; 2 0,-1.27
LEDC1608X80N = smd 0.95 x 0.95: 1 -0.75,0; 2 0.75,0
LRTBGVSRU4V2JWA6BBD8S2U27Z20S = smd 0.7 x 1.3: A1 -1.1,1.475; A2 0,1.475; A3 0,-1.475; C1 -1.1,-1.475; C2 1.1,1.475; C3 1.1,-1.475
LEDC3216X125N = smd 1.15 x 1.8: 1 -1.5,0; 2 1.5,0
SML0603 = smd 0.8 x 0.9: A 0.8,0; C -0.8,0
PS1240P02BT = drill 0.85 pad 2.413: 1 0,2.5; 2 0,-2.5
DMP2008UFG7 = smd 0.42 x 0.7: 1 -0.975,0; 2 -0.325,0; 3 0.325,0; 4 0.975,0; 5 0.975,3; 6 0.325,3; 7 -0.325,3; 8 -0.975,3 | smd 2.37 x 1.55: 9 0,1.875
R0402 = smd 0.6 x 0.7: 1 -0.5,0; 2 0.5,0
R0603 = smd 1 x 1.1: 1 -0.85,0; 2 0.85,0
RESC1608X55N = smd 0.79 x 0.93: 1 -0.82,0; 2 0.82,0
RESC1005X35N = smd 0.75 x 0.6: 1 -0.55,0; 2 0.55,0
RESC2012X65N = smd 0.97 x 1.38: 1 -0.93,0; 2 0.93,0
RESC3015X65N = smd 0.89 x 1.68: 1 -1.495,0; 2 1.495,0
RESC3216X75N = smd 1.2 x 1.8: 1 -1.5,0; 2 1.5,0
RESC3216X68N = smd 1.2 x 1.9: 1 -1.5,0; 2 1.5,0
L02P = drill 1.016 long: 1 1.25,-6.25; 2 -1.25,-6.25
TESTPOINT_PAD-036 = drill 0.35 pad 1.676: 1 0,0
101181930001LF = smd 0.4 x 1.35: 1 -1.3,2.6; 2 -0.65,2.6; 3 0,2.6; 4 0.65,2.6; 5 1.3,2.6 | drill 1.3 pad 1.95: MH1 -3.3,-0.075; MH2 3.3,-0.075 | smd 1.6 x 1.4: MP1 -3.2,2.375; MP4 3.2,2.375 | smd 1.9 x 1.6: MP2 -1.2,-0.075; MP3 1.2,-0.075
BM832 = smd 0.4 x 0.4: P$1 0.69,9.44; P$2 1.59,8.89; P$3 0.69,8.34; P$4 1.59,7.79; P$5 0.69,7.24; P$6 1.59,6.69; P$7 0.69,6.14; P$8 1.59,5.59; P$9 0.69,5.04; P$10 1.59,4.49; P$11 0.69,3.94; P$12 1.59,3.39; P$13 0.69,2.84; P$14 1.59,2.29; P$15 0.69,1.74; P$16 0.69,0.64; P$17 1.79,0.64; P$18 2.34,1.55; P$19 2.89,0.64; P$20 3.44,1.54; P$21 3.99,0.64; P$22 4.54,1.54; P$23 5.09,0.64; P$24 5.64,1.54; P$25 6.19,0.64; P$26 6.74,1.54; P$27 7.29,0.64; P$28 7.84,1.54; P$29 8.39,0.64; P$30 9.49,0.64; P$31 9.49,1.74; P$32 8.59,2.29; P$33 9.49,2.84; P$34 8.59,3.3; P$35 9.49,3.94; P$36 8.59,4.49; P$37 9.49,5.04; P$38 8.59,5.59; P$39 9.49,6.14; P$40 8.59,6.69; P$41 9.49,7.24; P$42 8.59,7.79; P$43 9.49,8.34; P$44 8.59,8.89; P$45 9.49,9.44; P$46 6.44,6.69; P$47 3.74,6.69
SOT50P160X60-6N = smd 0.7 x 0.35: 1 -0.735,0.5; 2 -0.735,0; 3 -0.735,-0.5; 4 0.735,-0.5; 5 0.735,0; 6 0.735,0.5

### Placement (x,y rotation side)
ANT1  5.21,42.55 0 top
C1  52.83,44.32 270 top
C2  56.64,27.43 0 top
C3  44.7,45.34 90 top
C4  5.71,47.62 0 top
C5  61.98,6.35 180 top
C6  59.18,9.14 90 top
C7  55.24,23.75 270 top
C8  53.09,23.75 270 top
C9  51.05,44.32 270 top
C11  61.98,4.32 180 top
C12  42.93,45.34 90 top
D1  15.75,6.6 0 top
D2  46.48,57.91 0 top
D3  51.31,13.34 90 top
G1  36.32,56.01 270 top
GND  2.54,5.59 270 top
IC2  62.23,9.14 270 top
IC3  53.85,26.92 0 top
J1  29.34,50.04 90 top
J2  39.12,35.81 180 top
L1  50.04,49.91 90 top
LED  2.54,17.53 270 top
LED1  60.45,11.94 0 top
LED2  17.78,25.15 180 top
LED3  3.81,26.42 270 top
LED4  34.16,26.8 270 top
LED5  27.56,26.42 270 top
LS1  37.59,7.62 90 top
NEG(-)  16.76,2.29 0 top
OUT  2.54,9.4 270 top
POS(+)  10.92,2.29 0 top
Q1  38.86,46.35 180 top
Q2  29.46,28.7 90 top
Q3  7.62,27.94 0 top
Q4  22.1,27.18 90 top
Q5  16,29.97 180 top
Q6  13.46,22.86 270 top
Q7  37.08,28.45 90 top
Q8  17.27,8.89 180 top
Q9  27.18,7.62 270 top
R1  62.74,11.94 270 top
R2  62.23,13.72 0 top
R3  51.18,27.18 0 top
R4  51.18,26.04 0 top
R5  47.12,42.67 180 top
R6  46.99,41.15 0 top
R7  24.89,11.43 0 top
R8  28.96,11.43 0 top
R9  28.96,15.75 0 top
R10  28.96,13.46 180 top
R11  29.46,22.1 0 top
R12  30.23,25.91 0 top
R13  29.46,23.88 180 top
R14  6.86,23.62 0 top
R15  7.62,25.65 0 top
R16  19.05,19.56 270 top
R17  22.86,23.37 0 top
R18  19.81,32 0 top
R19  13.72,26.92 90 top
R20  19.3,29.72 0 top
R21  16.51,18.03 0 top
R22  16.51,20.32 180 top
R23  37.59,21.84 0 top
R24  38.1,25.65 0 top
R25  37.34,23.62 180 top
R26  19.81,9.65 90 top
R27  8.89,7.62 270 top
R28  11.68,7.62 90 top
R29  6.6,13.72 0 top
R30  55.12,44.32 90 top
R31  52.32,30.73 270 top
R32  54.48,30.73 90 top
R33  33.66,48.39 180 top
SV1  51.56,3.68 180 top
TP1  48.77,58.8 270 top
TP2  48.01,11.81 0 top
TP3  57.15,42.04 270 top
TP4  57.91,46.35 270 top
TP5  9.91,13.72 90 top
TP6  57.28,6.73 0 top
TP8  30.23,9.91 0 top
TP11  8.76,4.7 0 top
TP12  19.18,2.41 0 top
TP13  20.32,25.78 0 top
TP14  14.61,29.21 0 top
TP15  15.88,22.1 0 top
TP16  3.43,29.59 0 top
TP17  26.29,30.86 0 top
TP18  35.05,29.84 0 top
TP19  46.99,9.65 0 top
TP20  36.58,43.31 0 top
TP21  49.91,39.12 0 top
TP22  62.99,2.67 0 top
U1  45.09,63.63 180 top
U2  0.25,49.91 0 top
U$1  48.13,45.97 90 top
VDD  2.54,13.72 270 top

### Tracks (layer width: path | path; a pad name or v marks a point on that pad's centre or on a via)
+3V3  (via drill 0.35, 0.35 pad 0.65, 0.35 pad 0.7, 0.35 pad 0.9, 0.61, 0.61 pad 1.91)
  Top 0.305: v35.69,21.84 R23.1 | R33.2 v31.88,48.39
  Top 0.381: v7.49,51.94 7.6,51.94 U2.P$28
  Top 0.406: R27.1 v8.89,10.16 | v28.57,16.76 28.14,16.32 R9.1 | v28.07,21.46 28.7,22.1 R11.1
  Top 0.508: v20.07,18.8 19.11,18.8 R16.2 | v17.53,16.76 17.44,16.85 R21.2 | U2.P$14 2.35,52.7 v2.54,52.7 | R31.1 52.11,31.37 v50.42,31.37 53,31.37 R32.1
  Top 0.61: v21.34,29.97 21.08,29.72 R20.2 | R29.2 7.45,14.69 v7.62,14.86 | v7.87,22.48 7.87,23.43 R14.2
  Top 0.762: R30.2 55.12,47.14 v56.54,48.56
  Top 0.813: R30.2 55.65,46.35 TP4.1
  Route15 0.508: v2.54,52.7 2.54,53.59 3.68,54.74 6.08,54.74 7.7,53.11 9.22,53.11 10.65,51.68 19.57,51.68 24.07,47.18 26.48,47.18 J1.1 | v21.34,29.97 21.34,34.19 20.19,35.34 20.19,39.12 11.68,47.62 11.68,48.9 8.64,51.94 v7.49,51.94
  pour Route15: 50.29,41.53 50.29,51.56 50.8,52.07 55.88,52.07 59.18,48.77 59.18,36.2 55.37,32.38 53.98,32.38 49.91,28.32 49.53,28.32 47.5,26.29 47.5,13.72 44.58,10.79 15.62,10.79 12.32,7.49 7.75,7.49 6.6,8.64 6.6,23.24 14.1,30.73 24.64,30.73 32.77,22.61 39.62,22.61 41.02,24 41.02,27.94 48.51,35.43 48.51,39.75
  pour Route15: 48.9,39.75 36.58,39.75 34.54,41.78 34.54,47.24 31.37,50.42 28.96,50.42 28.19,49.66 28.19,43.81 34.92,37.08 40.26,37.08 44.7,32.64 45.85,32.64 48.9,35.69 49.02,35.69 49.02,39.62
+3V6  (via drill 0.35 pad 0.75)
  Top 0.305: Q1.8 Q1.7 Q1.6 Q1.5 36.62,43.35 TP20.1 | 44.67,44.49 C12.1 42.89,44.45 v41.91,44.45 | C3.1 45.92,44.52 v45.97,44.58 | U$1.5 48.18,46.66 48.18,46.24 48.63,45.79 U$1.3 v48.64,44.32
  Top 0.508: Q1.6 38.86,43.68 Q1.9
  pour Route15: 35.81,44.2 35.18,43.56 35.18,42.04 36.2,41.02 42.29,41.02 44.2,41.02 46.35,43.18 46.74,43.18 49.15,43.18 49.28,43.31 49.66,43.69 49.66,44.58 49.28,44.96 49.02,44.96 48.51,44.96 48.26,44.7 48.13,44.58 48.13,44.2 47.88,43.94 47.37,43.94 46.48,44.83 46.48,45.21 46.23,45.47 45.85,45.47 41.4,45.47 41.02,45.09 40.39,44.45 40.26,44.32 39.62,44.32 35.94,44.32
+5V  (via drill 0.35 pad 0.7, 0.35 pad 0.9)
  Top 0.203: C11.1 63.25,4.32
  Top 0.305: 62.8,6.6 C5.1 | C11.1 62.99,4.15 TP22.1 | v37.08,46.35 Q1.4 | 46.38,59.01 D2.3 46.55,58.98 | U1.1 46.38,60.35 46.35,60.33
  Top 0.406: v64.77,8.13 63.6,8.13 IC2.4 | v63.63,12.95 63.49,12.95 R2.2
  Top 0.508: 46.35,60.33 46.55,60.13 46.55,58.98
  Top 0.61: 63.25,4.32 v64.26,5.33 64.07,5.33 62.8,6.6 | D2.3 48.66,58.91 TP1.1
  pour Route15: 40.77,59.82 60.2,59.82 67.94,52.07 67.94,4.32 64.77,1.14 62.36,1.14 61.72,1.78 61.72,7.37 64.39,10.03 64.39,11.43 62.23,13.59 62.23,50.42 57.53,55.12 47.62,55.12 41.27,48.77 38.61,48.77 37.85,48.01 37.85,45.85 36.96,44.96 36.32,44.96 35.69,45.59 35.69,54.74
+VBAT  (via drill 0.35 pad 0.8, 0.35 pad 0.9)
  Top 0.203: IC3.C3 54.61,26.16 54.61,25.23
  Top 0.305: Q1.1 40.6,47.12 v40.64,47.12 | SV1.1 47.27,9.93 TP19.1
  Top 0.381: Q1.3 Q1.2
  Top 0.457: Q1.2 Q1.1 | C7.1 54.61,25.23
  Top 0.508: v56.39,24.51 55.33,24.51 C7.1
  Top 0.61: SV1.1 D3.3 50.31,14.49 v50.42,14.61
  Top 1.27: TP2.1 49.88,9.93 SV1.1
  pour Route15: 46.1,7.87 50.8,7.87 51.44,8.51 51.44,11.3 61.72,21.59 61.72,50.29 57.4,54.61 47.75,54.61 41.4,48.26 38.73,48.26 38.35,47.88 38.35,45.97 38.73,45.59 40.77,45.59 47.75,52.58 56.01,52.58 59.56,49.02 59.56,27.94 57.02,25.4 54.86,25.4 48.64,19.18 48.64,14.35 44.83,10.54 44.83,9.14
CHG_LED  (via drill 0.35)
  Top 0.305: U2.P$39 10.88,56.05 v10.92,56.01
GND  (via drill 0.35, 0.35 pad 0.6, 0.35 pad 0.7, 0.35 pad 0.9)
  Top 0.152: 51,43.61 C9.2 | 44.7,46.05 C3.2 | 42.82,45.9 C12.2 | 62.74,12.29 R1.1 | 23.01,28.19 Q4.2 | 30.48,29.72 Q2.2 | IC3.B2 IC3.C1
  Top 0.203: IC3.C1 v52.58,25.65
  Top 0.305: C3.2 v44.7,47.37 | v42.93,47.37 C12.2 | C9.2 v51.05,42.04 | U$1.2 48.13,44.74 47.99,44.59 47.99,44.56 v47.75,44.32
  Top 0.406: U2.P$45 7.96,59.35 v7.75,59.56
  Top 0.457: 55.12,22.77 55.12,21.97 v54.74,21.59 54.61,21.46 v53.85,21.46 53.21,21.46 v53.09,21.59 C8.2 | Q3.2 8.57,27.75 v8.76,27.94 | Q9.2 26.18,5.6
  Top 0.508: D2.1 45.52,56.9 v44.32,56.9
  Top 0.533: Q2.2 30.48,29.67 v30.48,30.63
  Top 0.559: C1.2 v52.83,42.04
  Top 0.61: v12.83,10.41 12.83,10.26 R28.2 11.05,9.76 v11.05,10.41 | Q8.2 15.26,9.89 v15.24,9.91 | 26.18,5.6 v26.16,5.59 | v3.81,4.32 GND.MP v3.81,6.86 | C5.2 v59.94,6.35 | C11.2 v59.94,4.32 | v10.41,48.26 9.74,48.93 U2.P$30 | U2.P$13 U2.P$15 1.18,51.65 v1.65,51.18 1.66,51.18 1.67,51.18 2.32,51.18 U2.P$18 3.14,50.91 U2.P$19 | U2.P$1 2.39,59.35 | v2.79,59.44 2.71,59.35 2.39,59.35 | U2.P$2 2.39,59.35 | U2.P$3 1.11,58.42 v2.79,58.42 2.56,58.42 U2.P$4 | U2.P$5 1.38,57.15 1.47,57.23 2.75,57.23 v2.79,57.28 | U1.MH1 50.34,63.7 v50.55,63.5 | U1.MH2 41.71,63.63 v39.75,63.63 | G1.P$1 v38.72,62.47 v38.73,62.48 | G1.P$2 34.17,62.37 v34.29,62.48 | J1.9 29.46,60.33 v31.11,60.33 | J1.5 30.99,55.12 v31.11,55.24 | J1.3 30.99,52.58 v31.11,52.45 | D3.1 52.81,11.88 SV1.2 | v47.37,39.75 47.84,40.22 R6.2 47.84,40.17 v48.26,39.75 | C12.2 42.93,46.61 v43.81,47.5 43.81,47.05 C3.2
  Bottom 0.61: SV1.2 52.81,9.12 v51.82,8.13 | SV1.2 52.81,7.89 v52.83,7.87 | SV1.2 52.81,9.29 v53.85,8.26
  other vias: 49.28,21.21 48.13,19.94 48.01,22.86 49.28,24.13 48.13,17.4 24.77,38.48 16.89,41.02 35.05,45.47 19.3,38.48 58.8,30.35 37.59,40.13 42.29,34.92 56.77,29.59 1.65,33.27 4.45,33.15 1.52,30.73 3.05,31.75 4.7,30.73 1.52,22.73 4.32,22.61 1.4,20.19 2.92,21.21 4.45,20.45 5.46,18.54 6.22,17.4 5.46,16.13 6.22,19.81 6.22,15.11 5.84,9.27 20.45,7.24 6.22,5.59 22.73,5.84 23.5,9.02 24.64,3.81 30.1,5.71 5.71,2.67 28.07,3.94 22.23,2.41 3.56,1.4 8,1.4 26.54,2.16 53.09,63.75 54.36,62.74 55.63,63.75 56.9,62.74 55.88,61.59 58.17,63.75 59.05,62.74 58.17,61.47 60.58,63.63 63.12,63.63 61.85,62.61 60.96,61.47 64.64,62.61 67.18,62.61 65.91,61.59 64.64,60.33 67.18,60.33 65.91,59.31 64.64,57.91 67.18,57.91 65.91,56.9 66.17,63.88 63.12,61.34 62.99,59.44 58.17,16.89 60.71,16.89 59.44,15.88 59.44,18.16 18.92,62.74 21.21,62.74 19.94,61.72 20.19,64.01 56.26,32.64 58.8,32.64 57.53,31.62 57.78,33.91 18.03,64.01 17.91,61.98 42.29,40.13 39.75,40.64 30.99,2.41 32.51,1.4 34.04,2.67 37.08,3.43 38.61,2.41 40.13,3.68
  pour Top: 16.38,65.15 16.38,60.33 0,60.33 0,49.91 5.21,49.91 6.22,50.93 6.22,51.56 6.48,51.82 8.38,51.82 9.14,51.05 9.14,49.02 10.92,47.24 10.92,39.12 6.35,34.54 0,34.54 0,0 68.96,0 68.96,65.15
  pour Route2: 16.26,65.15 16.26,60.33 0,60.33 0,49.91 5.33,49.91 6.22,50.8 6.22,51.44 6.6,51.82 8.26,51.82 9.14,50.93 9.14,49.02 10.92,47.24 10.92,39.12 6.48,34.67 0,34.67 0,0 68.96,0 68.96,65.15
  pour Bottom: 16.26,65.15 16.26,60.33 0,60.33 0,50.04 5.33,50.04 6.22,50.93 6.22,51.44 6.6,51.82 8.26,51.82 9.14,50.93 9.14,49.02 10.92,47.24 10.92,39.12 6.48,34.67 0,34.67 0,0 68.96,0 68.96,65.15
LED_BLUE  (via drill 0.35)
  Top 0.305: J2.9 20.63,33.98 R18.2 | U2.P$35 v10.92,53.85
  Bottom 0.305: v10.92,53.85 14.1,53.85 18.76,49.18 18.76,38.26 18.8,38.22 J2.9
LED_GRN  (via drill 0.35)
  Top 0.305: v24.13,25.15 24.34,24.94 R17.2 | U2.P$36 7.45,54.4 v7.11,54.74
  Bottom 0.305: v24.13,25.15 24.13,33.02 J2.8 22.1,36.58 22.1,47.24 14.86,54.48 7.37,54.48 v7.11,54.74
LED_ORNG  (via drill 0.35)
  Top 0.305: R12.2 31.05,26.73 v32,27.69 | U2.P$37 10.76,54.95 v10.92,55.12
  Bottom 0.305: v32,27.69 J2.7 23.88,46.74 15.49,55.12 v10.92,55.12
LED_PRPL  (via drill 0.35)
  Top 0.305: v9.65,27.43 9.65,26.16 9.53,26.04 9.53,25.99 R15.2 | U2.P$33 10.49,52.75 v10.92,52.32
  Bottom 0.305: v9.65,27.43 9.65,31.88 13.59,35.81 J2.11 13.79,35.88 13.79,51.11 12.57,52.32 v10.92,52.32
LED_RED  (via drill 0.35)
  Top 0.305: R19.2 12.52,27.74 v11.94,28.32 | U2.P$34 8.84,53.39 v8.38,53.85
  Bottom 0.305: v11.94,28.32 11.94,31.5 J2.10 15.56,36.51 15.56,50.38 12.85,53.09 9.14,53.09 v8.38,53.85
LED_YEL  (via drill 0.35)
  Top 0.305: R24.2 38.92,26.73 v39.62,27.43 | U2.P$41 10.67,57.15 v10.92,56.9
  Bottom 0.305: v39.62,27.43 35.81,31.24 30.99,31.24 J2.6 26.42,45.34 14.86,56.9 v10.92,56.9
MOTOR  (via drill 0.35, 0.35 pad 0.65)
  Top 0.305: R26.1 20.12,9.14 v21.08,9.14 | U2.P$31 10.32,51.65 11.56,50.42 11.56,48.64 12.32,47.88 v12.7,47.88 15.49,47.88 18.03,45.34 21.46,45.34 28.41,38.39 28.41,38.38 28.96,37.84 J2.5
  Bottom 0.305: J2.5 32.51,32.26 36.07,32.26 41.91,26.42 41.91,16 40.39,14.48 23.37,14.48 21.08,12.19 v21.08,9.14
N$1
  Top 0.305: Q9.1 25.71,9.04 R7.2
N$3
  Top 0.152: 28.19,7.62 Q9.3
  Top 0.305: R8.1 28.19,11.37 28.19,7.62
  Top 0.61: Q9.3 LS1.1
N$4
  Top 0.305: R1.2 63.53,10.65 IC2.5
N$5
  Top 0.305: U$1.4 48.63,49.78 L1.1
N$6
  Top 0.203: R5.2 46.62,41.62 R6.1
  Top 0.254: U$1.1 46.62,44.22 R5.2
N$7
  Top 0.305: IC2.1 59.7,11.32 LED1.1
N$8
  Top 0.305: LED1.2 61.2,13.19 R2.1
N$9
  Top 0.305: Q8.1 18.8,10.47 R26.2
N$10
  Top 0.203: IC3.B1 53.07,26.92 52.18,26.04 R4.2
N$12
  Top 0.305: R10.1 29.78,13.14 R8.2 29.78,10.36 TP8.1
  Top 0.508: R9.2 29.78,13.78 R10.1
  Top 0.61: R8.2 36.15,11.43 LS1.2
N$13
  Top 0.305: D1.C 13.58,6.12 R28.1 R27.2 8.76,6 TP11.1
  Top 0.61: R28.1 11.68,3.05 POS(+).MP
N$14
  Top 0.305: R12.1 29.41,26.69 Q2.1
N$15
  Top 0.61: TP17.1 28.45,28.7 Q2.3 27.56,27.8 LED5.C
N$16
  Top 0.203: R13.1 30.28,22.37 R11.2
N$17
  Top 0.61: R13.2 28.54,23.88 27.56,24.85 LED5.A
N$18
  Top 0.203: R5.1 49.66,42.67 50.04,43.05 50.04,44.13 C9.1
  Top 0.305: R5.1 48.63,42.67 49.91,41.39 TP21.1
  Top 0.559: C1.1 53.57,44.41 53.73,44.41 55.12,43.01 R30.1
  Top 0.61: 51.05,49.66 L1.2
  Top 0.711: 51.05,49.66 C9.1 C1.1
  Top 0.813: R30.1 56.36,42.82 TP3.1
N$19
  Top 0.305: Q3.1 6.8,26.81 R15.1
N$20
  Top 0.305: Q3.3 4.83,28.94 LED3.1 3.43,28.3 TP16.1
N$21
  Top 0.305: LED3.2 5.1,23.62 R14.1
N$22
  Top 0.305: R22.2 15.69,18.14 R21.1
N$23
  Top 0.305: Q4.1 23.1,24.43 R17.1
N$24
  Top 0.305: LED2.C1 19.31,27.05 20.97,27.05 Q4.3 20.32,26.4 TP13.1
N$25
  Top 0.305: Q8.3 17.27,6.76 D1.A | NEG(-).MP 19.05,2.29 TP12.1
  Top 0.61: D1.A 17.43,2.95 NEG(-).MP
N$26
  Top 0.305: Q5.1 17.98,32 R18.1
N$27  (via drill 0.35 pad 0.9)
  Top 0.203: IC3.C2 53.85,25.72 53.09,24.96 C8.1
  Top 0.305: IC2.3 59.31,8.19 C6.1 | TP6.1 57.28,8 v57.53,8.26
  Top 0.508: C6.1 59.11,8.26 v57.53,8.26
  Top 0.635: C8.1 53,24.51 v51.05,24.51
  Bottom 1.27: v51.05,24.51 51.05,20.19 57.53,13.72 v57.53,8.26
N$28
  Top 0.305: R19.1 13.72,25.06 Q6.1
N$29
  Top 0.305: LED2.C3 16.68,28.29 Q5.3 14.84,28.97 TP14.1
N$30
  Top 0.305: LED2.A3 17.78,29.12 R20.1
N$31
  Top 0.305: LED2.A1 18.88,20.55 R16.1
N$32
  Top 0.305: LED2.C2 15.27,23.67 Q6.3 15.22,22.1 TP15.1
N$33
  Top 0.203: LED2.A2 17.78,23.62
  Top 0.305: 17.78,23.62 17.78,20.77 R22.1
N$36
  Top 0.305: R24.1 37.28,26.69 Q7.1
N$37
  Top 0.61: TP18.1 35.05,29.48 Q7.3 35.01,28.45 LED4.C
N$38
  Top 0.305: LED4.A 36.52,23.64 R25.2
N$39
  Top 0.305: R25.1 38.41,23.37 38.41,21.95 R23.2
N$43  (via drill 0.35)
  Top 0.203: IC3.B3 54.47,27.05 54.5,27.05 54.88,27.43 C2.1 55.75,27.47 v55.75,28.32 | R3.1 v49.91,27.18
  Route15 0.203: v49.91,27.18 54.61,27.18 v55.75,28.32
NFC1
  Top 0.381: U2.P$26 6.99,49.76 5.12,47.88 C4.1 2.61,45.12 ANT1.1 2.61,36.76 J2.15
NFC2
  Top 0.381: U2.P$29 8.64,49.95 C4.2 7.81,46.13 ANT1.2 7.81,37.52 J2.14
PWR_BUTT  (via drill 0.35, 0.35 pad 0.9)
  Top 0.305: U2.P$46 5.88,56.6 v5.84,56.64
  Top 0.61: v36.58,48.39 38.72,50.53 G1.P$3 | v36.58,48.39 34.17,50.79 G1.P$4 | v36.58,48.39 R33.1
  Bottom 0.305: v5.84,56.64 8.64,59.44 13.84,59.44 15.62,57.66 17.27,57.66 28.03,46.9 35.09,46.9 v36.58,48.39
RESET  (via drill 0.35, 0.35 pad 0.65)
  Top 0.254: v17.53,60.2 J1.10
  Top 0.305: U2.P$40 8.76,56.52 v7.62,56.52
  Route15 0.305: v17.53,60.2 17.05,59.72 10.83,59.72 v7.62,56.52
SCL  (via drill 0.35, 0.35 pad 0.65)
  Top 0.203: v54.61,28.45 54.61,27.69 IC3.A3
  Top 0.305: U2.P$20 3.69,53.6 v4.06,53.98 | v54.61,28.45 55.5,29.34 55.5,30.57 R32.2 53.43,32.64 42.29,32.64 J2.1 36.48,38.45 31.72,38.45 22.79,47.37 19.18,47.37 16.26,50.29 v12.7,50.29
  Bottom 0.254: v4.06,53.98 7.18,53.98 9.38,51.77 11.22,51.77 v12.7,50.29
SDA  (via drill 0.35, 0.35 pad 0.65)
  Top 0.203: v53.59,28.45 v53.59,28.44 53.85,28.19 IC3.A2
  Top 0.305: U2.P$21 4.24,52.88 v4.45,53.09 | v53.59,28.45 53.59,29.25 52.96,29.88 R31.2 42.51,29.88 J2.2 36.58,36.45 35.81,37.21 31.37,37.21 22.35,46.23 18.67,46.23 15.88,49.02 v12.7,49.02
  Bottom 0.254: v4.45,53.09 7.49,53.09 9.27,51.31 10.41,51.31 v12.7,49.02
SOC  (via drill 0.35)
  Top 0.203: IC3.A1 53.09,27.68 52.33,27.68 v52.07,27.94 51.68,27.55 R3.2
  Top 0.305: U2.P$44 14.13,58.8 16.04,56.9 v16.26,56.9
  Bottom 0.305: J2.3 34.1,35.75 | 34.1,35.75 35.94,33.91 37.34,33.91 43.31,27.94 v52.07,27.94 | v16.26,56.9 34.1,39.05 34.1,35.75
SPKR  (via drill 0.35)
  Top 0.254: U2.P$32 8.46,52.58 6.74,52.58 v6.6,52.45
  Top 0.305: R7.1 23.41,13 v23.62,13.21
  Route15 0.305: v6.6,52.45 6.73,52.58 8.76,52.58 10.29,51.05 17.02,51.05 31.5,36.58 J2.4
  Bottom 0.305: J2.4 34.16,33.15 36.45,33.15 42.8,26.8 42.8,15.62 40.39,13.21 v23.62,13.21
SWCLK  (via drill 0.35)
  Top 0.254: U2.P$42 10.58,57.7 v10.67,57.78 | J1.4 18.03,52.58 v12.45,58.17
  Bottom 0.254: v10.67,57.78 12.06,57.78 v12.45,58.17
SWDIO
  Top 0.254: U2.P$43 10.4,58.25 10.45,58.3 11.17,58.3 19.43,50.04 J1.2
SWO  (via drill 0.35, 0.35 pad 0.65)
  Top 0.254: J1.6 23.37,58.55 v16.13,58.55
  Top 0.305: v7.87,55.37 8,55.5 U2.P$38
  Route15 0.305: v7.87,55.37 7.87,55.88 11.21,59.22 15.46,59.22 v16.13,58.55
TOUCHLED
  Bottom 0.305: J2.13 5.43,32.6 5.43,20.41 LED.MP
TOUCHOUT  (via drill 0.35)
  Top 0.305: v5.46,52.32 4.79,51.66 U2.P$22
  Bottom 0.305: OUT.MP 6.86,13.72 6.86,31.5 J2.12 11.3,35.94 11.3,48.39 8.29,51.4 6.89,51.4 5.96,52.32 v5.46,52.32
TOUCHVDD
  Top 0.61: R29.1 VDD.MP
(copper drawn outside any net)
  shapes: Route15 area x1, Route2 area x2, Top area x2

### Text on the board
tPlace: TOUCHOUT | PRPL | RED | BLUE | GRN | ORNG | YEL | NFC2 | NFC1 | TCHLED | MOTOR | SPKR | SOC | SDA | SCL
tNames: TETHERBAND / PC-004 V1.0